# Altium project IFAT6.PrjPcb (part 3 of 3)

## Sheet Sig_Acq.SchDoc
size 457 x 254 mm; SPICEModelCacheCRLRCMOW: <root> / <DocumentId>CRLRCMOW</DocumentId> / <CacheFrame Number="0"> / <Model Name="cap" Kind="MDL"> / <Text>*Default semiconductor capacitor / .MODEL CAP C()</Text> / </Model> / </CacheFrame> / </root>
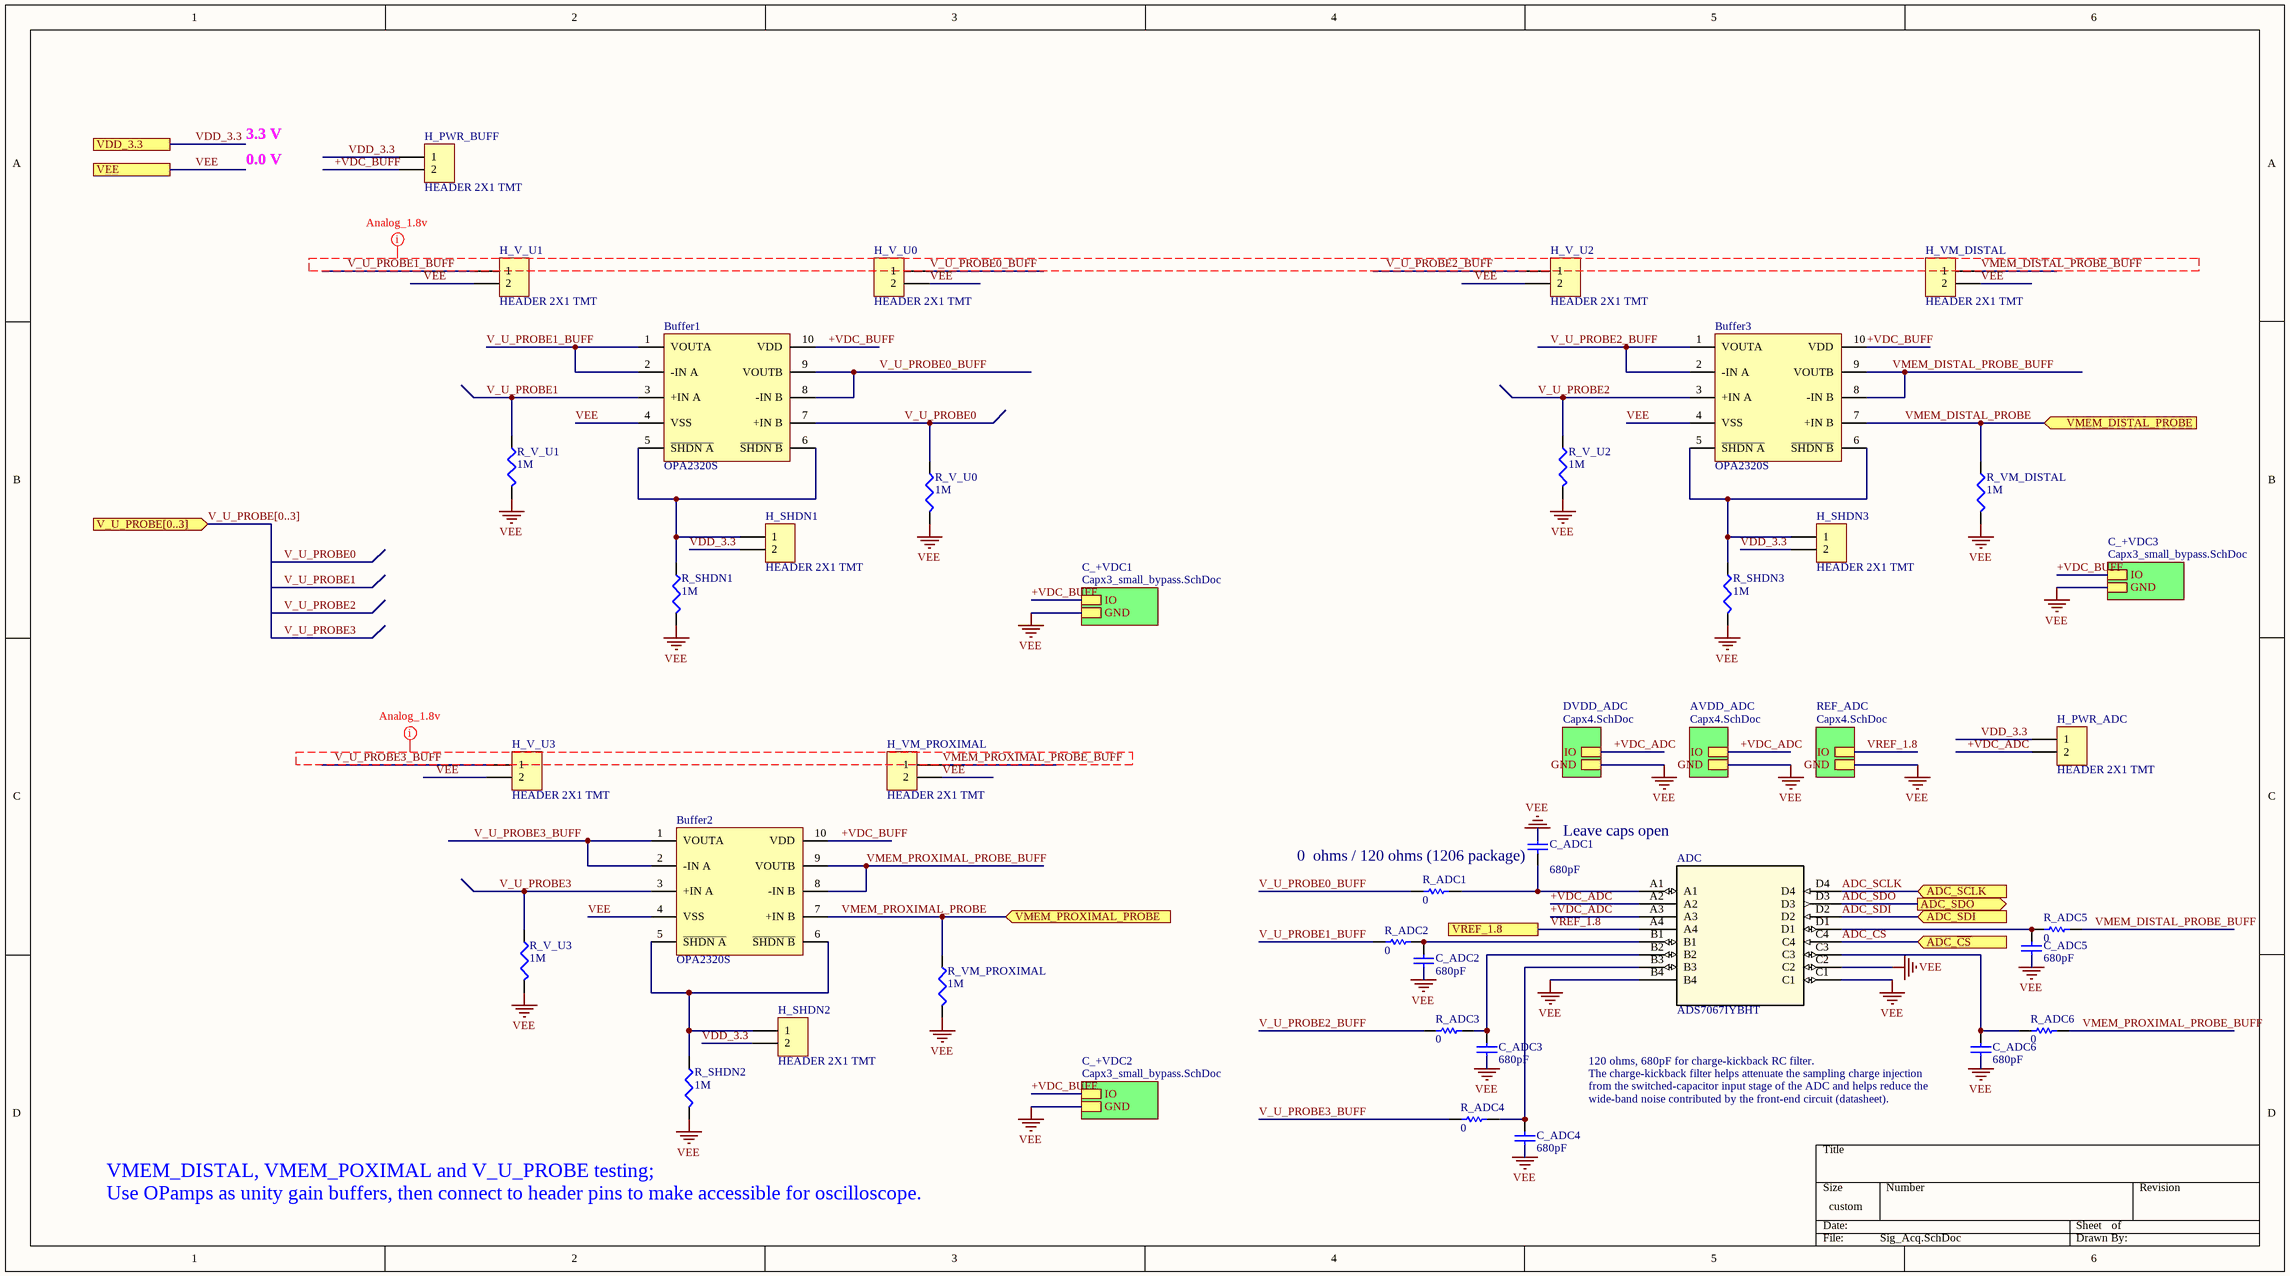
[diagram p10: Sig_Acq.SchDoc]

### Parts
ADC  ADS7067IYBHT  [BGA16_YBH_TEX]
Buffer1  OPA2320S  [TI OPA2320SAIDGSR]
Buffer2  OPA2320S  [TI OPA2320SAIDGSR]
Buffer3  OPA2320S  [TI OPA2320SAIDGSR]
C_ADC1  value 680pF  [THERM_NCP18XH103F03RB]  (hidden comment: Cap)
C_ADC2  value 680pF  [THERM_NCP18XH103F03RB]  (hidden comment: Cap)
C_ADC3  value 680pF  [THERM_NCP18XH103F03RB]  (hidden comment: Cap)
C_ADC4  value 680pF  [THERM_NCP18XH103F03RB]  (hidden comment: Cap)
C_ADC5  value 680pF  [THERM_NCP18XH103F03RB]  (hidden comment: Cap)
C_ADC6  value 680pF  [THERM_NCP18XH103F03RB]  (hidden comment: Cap)
H_PWR_ADC  HEADER 2X1 TMT  [Samtec TSW-102-07-G-S]
H_PWR_BUFF  HEADER 2X1 TMT  [Samtec TSW-102-07-G-S]
H_SHDN1  HEADER 2X1 TMT  [Samtec TSW-102-07-G-S]
H_SHDN2  HEADER 2X1 TMT  [Samtec TSW-102-07-G-S]
H_SHDN3  HEADER 2X1 TMT  [Samtec TSW-102-07-G-S]
H_V_U0  HEADER 2X1 TMT  [Samtec TSW-102-07-G-S]
H_V_U1  HEADER 2X1 TMT  [Samtec TSW-102-07-G-S]
H_V_U2  HEADER 2X1 TMT  [Samtec TSW-102-07-G-S]
H_V_U3  HEADER 2X1 TMT  [Samtec TSW-102-07-G-S]
H_VM_DISTAL  HEADER 2X1 TMT  [Samtec TSW-102-07-G-S]
H_VM_PROXIMAL  HEADER 2X1 TMT  [Samtec TSW-102-07-G-S]
R_ADC1  0  [RESC3216X70X50NL05T20]
R_ADC2  0  [RESC3216X70X50NL05T20]
R_ADC3  0  [RESC3216X70X50NL05T20]
R_ADC4  0  [RESC3216X70X50NL05T20]
R_ADC5  0  [RESC3216X70X50NL05T20]
R_ADC6  0  [RESC3216X70X50NL05T20]
R_SHDN1  value 1M  [Panasonic ERA-6A Series Resistor]  (hidden comment: Res 1M 0.1% 0805)
R_SHDN2  value 1M  [Panasonic ERA-6A Series Resistor]  (hidden comment: Res 1M 0.1% 0805)
R_SHDN3  value 1M  [Panasonic ERA-6A Series Resistor]  (hidden comment: Res 1M 0.1% 0805)
R_V_U0  value 1M  [Panasonic ERA-6A Series Resistor]  (hidden comment: Res 1M 0.1% 0805)
R_V_U1  value 1M  [Panasonic ERA-6A Series Resistor]  (hidden comment: Res 1M 0.1% 0805)
R_V_U2  value 1M  [Panasonic ERA-6A Series Resistor]  (hidden comment: Res 1M 0.1% 0805)
R_V_U3  value 1M  [Panasonic ERA-6A Series Resistor]  (hidden comment: Res 1M 0.1% 0805)
R_VM_DISTAL  value 1M  [Panasonic ERA-6A Series Resistor]  (hidden comment: Res 1M 0.1% 0805)
R_VM_PROXIMAL  value 1M  [Panasonic ERA-6A Series Resistor]  (hidden comment: Res 1M 0.1% 0805)

### Sub-sheets
AVDD_ADC = Capx4.SchDoc: IO, GND
C_+VDC1 = Capx3_small_bypass.SchDoc: IO, GND
C_+VDC2 = Capx3_small_bypass.SchDoc: IO, GND
C_+VDC3 = Capx3_small_bypass.SchDoc: IO, GND
DVDD_ADC = Capx4.SchDoc: IO, GND
REF_ADC = Capx4.SchDoc: IO, GND

### Ports
ADC_SCLK (in), ADC_SDI (in), ADC_SDO (out), ADC_~{CS} (in), V_U_PROBE[0..3] (in), VDD_3.3, VEE, VMEM_DISTAL_PROBE (in), VMEM_PROXIMAL_PROBE (in), VREF_1.8

### Nets
VEE: ADC.B4 ADC.C1 ADC.C2 Buffer1.4(VSS) Buffer2.4(VSS) Buffer3.4(VSS) C_ADC1.2 C_ADC2.2 C_ADC3.2 C_ADC4.2 C_ADC5.2 C_ADC6.2 H_V_U0.2 H_V_U1.2 H_V_U2.2 H_V_U3.2 H_VM_DISTAL.2 H_VM_PROXIMAL.2 R_SHDN1.2 R_SHDN2.2 R_SHDN3.2 R_V_U0.2 R_V_U1.2 R_V_U2.2 R_V_U3.2 R_VM_DISTAL.2 R_VM_PROXIMAL.2 ; port VEE, sheet C_+VDC3/GND, sheet C_+VDC2/GND, sheet C_+VDC1/GND, sheet DVDD_ADC/GND, sheet REF_ADC/GND, sheet AVDD_ADC/GND  [project net DGND]
+VDC_ADC: ADC.A2 ADC.A3 H_PWR_ADC.2 ; sheet DVDD_ADC/IO, sheet AVDD_ADC/IO
+VDC_BUFF: Buffer1.10(VDD) Buffer2.10(VDD) Buffer3.10(VDD) H_PWR_BUFF.2 ; sheet C_+VDC3/IO, sheet C_+VDC2/IO, sheet C_+VDC1/IO
ADC_~{CS}: ADC.C4 ; port ADC_~{CS}
ADC_SCLK: ADC.D4 ; port ADC_SCLK
ADC_SDI: ADC.D2 ; port ADC_SDI
ADC_SDO: ADC.D3 ; port ADC_SDO
V_U_PROBE0: Buffer1.7(+IN_B) R_V_U0.1
V_U_PROBE0_BUFF: Buffer1.8(-IN_B) Buffer1.9(VOUTB) H_V_U0.1 R_ADC1.1
V_U_PROBE1: Buffer1.3(+IN_A) R_V_U1.1
V_U_PROBE1_BUFF: Buffer1.1(VOUTA) Buffer1.2(-IN_A) H_V_U1.1 R_ADC2.1
V_U_PROBE2: Buffer3.3(+IN_A) R_V_U2.1
V_U_PROBE2_BUFF: Buffer3.1(VOUTA) Buffer3.2(-IN_A) H_V_U2.1 R_ADC3.1
V_U_PROBE3: Buffer2.3(+IN_A) R_V_U3.1
V_U_PROBE3_BUFF: Buffer2.1(VOUTA) Buffer2.2(-IN_A) H_V_U3.1 R_ADC4.1
VDD_3.3: H_PWR_ADC.1 H_PWR_BUFF.1 H_SHDN1.2 H_SHDN2.2 H_SHDN3.2 ; port VDD_3.3  [project net VDD3.3]
VMEM_DISTAL_PROBE: Buffer3.7(+IN_B) R_VM_DISTAL.1 ; port VMEM_DISTAL_PROBE
VMEM_DISTAL_PROBE_BUFF: Buffer3.8(-IN_B) Buffer3.9(VOUTB) H_VM_DISTAL.1 R_ADC5.2
VMEM_PROXIMAL_PROBE: Buffer2.7(+IN_B) R_VM_PROXIMAL.1 ; port VMEM_PROXIMAL_PROBE
VMEM_PROXIMAL_PROBE_BUFF: Buffer2.8(-IN_B) Buffer2.9(VOUTB) H_VM_PROXIMAL.1 R_ADC6.2
VREF_1.8: ADC.A4 ; port VREF_1.8, sheet REF_ADC/IO  [project net DAC_VREF_1.8]
NetADC_A1: ADC.A1 C_ADC1.1 R_ADC1.2
NetADC_B1: ADC.B1 C_ADC2.1 R_ADC2.2
NetADC_B2: ADC.B2 C_ADC3.1 R_ADC3.2
NetADC_B3: ADC.B3 C_ADC4.1 R_ADC4.2
NetADC_C3: ADC.C3 C_ADC6.1 R_ADC6.1
NetADC_D1: ADC.D1 C_ADC5.1 R_ADC5.1
NetBuffer1_5: Buffer1.5(~{SHDN_A}) Buffer1.6(~{SHDN_B}) H_SHDN1.1 R_SHDN1.1
NetBuffer2_5: Buffer2.5(~{SHDN_A}) Buffer2.6(~{SHDN_B}) H_SHDN2.1 R_SHDN2.1
NetBuffer3_5: Buffer3.5(~{SHDN_A}) Buffer3.6(~{SHDN_B}) H_SHDN3.1 R_SHDN3.1

### Buses and harness runs
bus V_U_PROBE[0..3] = port V_U_PROBE[0..3]

### Layout directives
net class Analog: V_U_PROBE0_BUFF, V_U_PROBE1_BUFF, V_U_PROBE2_BUFF, V_U_PROBE3_BUFF, VMEM_DISTAL_PROBE_BUFF, VMEM_PROXIMAL_PROBE_BUFF

### Notes on the sheet
- 3.3 V
- 0.0 V
- (near C_ADC1) Leave caps open
- (near C_ADC1) 0  ohms / 120 ohms (1206 package)
- 120 ohms, 680pF for charge-kickback RC filter.
- (near C_ADC6) The charge-kickback filter helps attenuate the sampling charge injection
- (near C_ADC6) from the switched-capacitor input stage of the ADC and helps reduce the
- wide-band noise contributed by the front-end circuit (datasheet).
- VMEM_DISTAL, VMEM_POXIMAL and V_U_PROBE testing;
  Use OPamps as unity gain buffers, then connect to header pins to make accessible for oscilloscope.

### Library data of the parts
ADC = ADS7067IYBHT: No Description Available; Mfr_Name: Texas Instruments; Copyright: Copyright (C) 2022 Ultra Librarian. All rights reserved.; Manufacturer_Part_Number: ADS7067IYBHT; RefDes: RefDes; Type: DEV
Buffer1-Buffer3 = OPA2320S: IC OPAMP RR CMOS 20MHZ 10VSSOP / CMOS Amplifier Circuit Rail-to-Rail 10-VSSOP; Supplier 1: Digi-Key; Supplier 2: Digi-Key; Supplier 3: Mouser; Supplier Part Number 1: 296-40455-1-ND; Supplier Part Number 2: 296-48160-1-ND; Supplier Part Number 3: 595-OPA2320SAIDGSR
C_ADC1-C_ADC6 = Cap: Capacitor; Published: 8-Jun-2000; LatestRevisionDate: 17-Jul-2002; LatestRevisionNote: Re-released for DXP Platform.; PackageReference: RAD-0.3; Publisher: Altium Limited; PackageDescription: Radial Cap, Thru-Hole; 2 Leads; 0.3 in Pin Spacing; Supplier 1: Mouser; Supplier Part Number 1: 81-GCM1885C1H681FAD
H_PWR_ADC H_PWR_BUFF H_SHDN1-H_SHDN3 H_V_U0-H_V_U3 H_VM_DISTAL H_VM_PROXIMAL = HEADER 2X1 TMT: CONN HEADER VERT 2POS 2.54MM / Connector Header Through Hole 2 position 0.100" (2.54mm); Supplier 1: Digi-Key; Supplier Part Number 1: SAM1029-02-ND
R_ADC1-R_ADC6 = CMP-2003-00541-1: Manufacturer: Panasonic; Part Number: ERJ-8GEY0R00V
R_SHDN1-R_SHDN3 R_V_U0-R_V_U3 R_VM_DISTAL R_VM_PROXIMAL = Res 1M 0.1% 0805: RES 1M OHM 0.1% 1/8W 0805 / 1 ±0.1% 0.125W, 1/8W Chip Resistor 0805 (2012 Metric) Automotive AEC-Q200 Thin Film; Supplier 1: Digi-Key; Supplier Part Number 1: P1MDACT-ND; Supplier 2: Digi-Key; Supplier Part Number 2: YAG1821CT-ND

## Sheet BRK7010_sj.SchDoc: BRK6110
size C; Author: Jake Janovetz; Organization: Opal Kelly; Address1: 13500 SW 72nd Ave, STE 120; Address2: Portland, OR 97223; Address4: http://www.opalkelly.com; DocumentNumber: xxx; Revision: 1; SheetNumber: 1; SheetTotal: 1; PageSetup: Record=PageOptions|CenterHorizontal=True|CenterVertical=True|PrintScale=0.54|XCorrection=1.00|YCorrection=1.00|PrintKind=0|BorderSize=5000000|LeftOffset=0|BottomOffset=0|Orientation=2|PaperLength=1000|PaperWidth=1000|Scale=100|PaperSource=7|PrintQuality=-4|MediaType=1|DitherType=10|PaperKind=Letter|PrintScaleMode=1
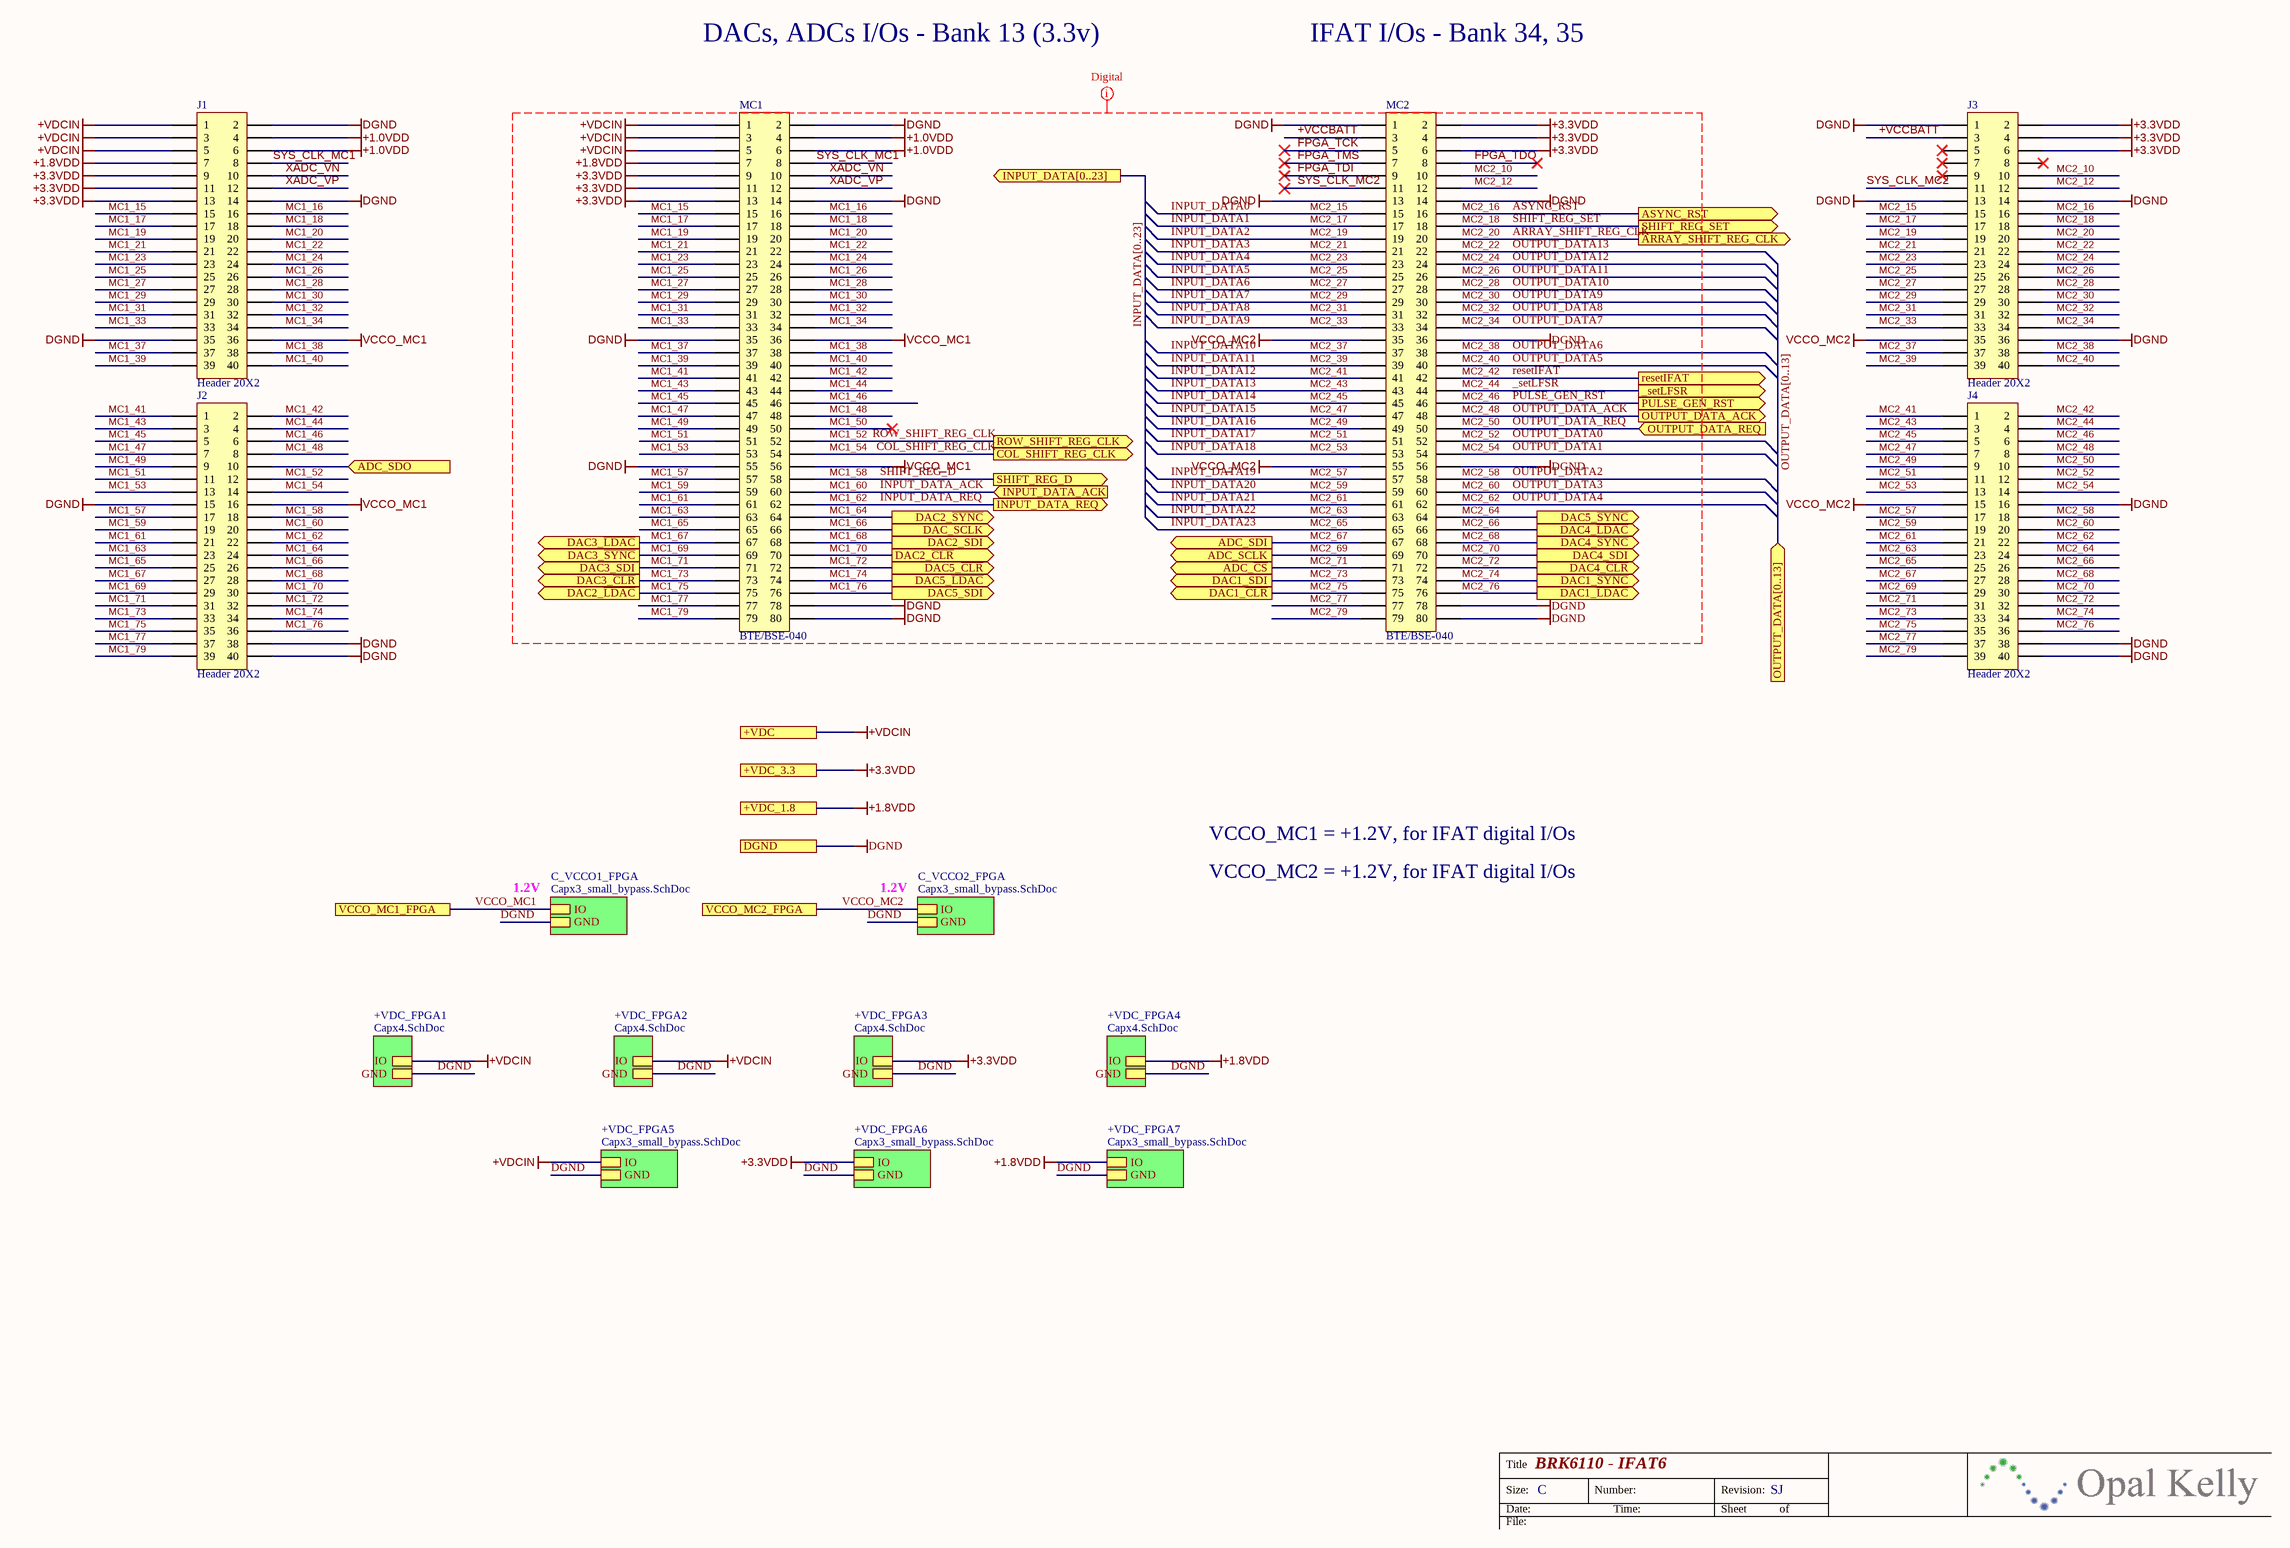
[diagram p11: BRK7010_sj.SchDoc]

### Parts
J1  Header 20X2  [Samtec TMMH-120-01-F-D]
J2  Header 20X2  [Samtec TMMH-120-01-F-D]
J3  Header 20X2  [Samtec TMMH-120-01-F-D]
J4  Header 20X2  [Samtec TMMH-120-01-F-D]
MC1  BTE/BSE-040  [Samtec BTE-040-01-L-D-A]
MC2  BTE/BSE-040  [Samtec BTE-040-01-L-D-A]

### Sub-sheets
+VDC_FPGA1 = Capx4.SchDoc: IO, GND
+VDC_FPGA2 = Capx4.SchDoc: IO, GND
+VDC_FPGA3 = Capx4.SchDoc: IO, GND
+VDC_FPGA4 = Capx4.SchDoc: IO, GND
+VDC_FPGA5 = Capx3_small_bypass.SchDoc: IO, GND
+VDC_FPGA6 = Capx3_small_bypass.SchDoc: IO, GND
+VDC_FPGA7 = Capx3_small_bypass.SchDoc: IO, GND
C_VCCO1_FPGA = Capx3_small_bypass.SchDoc: IO, GND
C_VCCO2_FPGA = Capx3_small_bypass.SchDoc: IO, GND

### Ports
+VDC, +VDC_1.8, +VDC_3.3, _setLFSR (out), ADC_SCLK (out), ADC_SDI (out), ADC_SDO (in), ADC_~{CS} (out), ARRAY_SHIFT_REG_CLK (out), ASYNC_RST (out), COL_SHIFT_REG_CLK (out), DAC1_SDI (out), DAC1_~{CLR} (out), DAC1_~{LDAC} (out), DAC1_~{SYNC} (out), DAC2_SDI (out), DAC2_~{CLR} (out), DAC2_~{LDAC} (out), DAC2_~{SYNC} (out), DAC3_SDI (out), DAC3_~{CLR} (out), DAC3_~{LDAC} (out), DAC3_~{SYNC} (out), DAC4_SDI (out), DAC4_~{CLR} (out), DAC4_~{LDAC} (out), DAC4_~{SYNC} (out), DAC5_SDI (out), DAC5_~{CLR} (out), DAC5_~{LDAC} (out), DAC5_~{SYNC} (out), DAC_SCLK (out), DGND, INPUT_DATA[0..23] (out), INPUT_DATA_ACK (in), INPUT_DATA_REQ (out), OUTPUT_DATA[0..13] (in), OUTPUT_DATA_ACK (out), OUTPUT_DATA_REQ (in), PULSE_GEN_RST (out), resetIFAT (out), ROW_SHIFT_REG_CLK (out), SHIFT_REG_D (out), SHIFT_REG_SET (out), VCCO_MC1_FPGA, VCCO_MC2_FPGA

### Nets
+1.0VDD: J1.4 J1.6 MC1.4 MC1.6
+1.8VDD: J1.7 MC1.7 ; port +VDC_1.8, sheet +VDC_FPGA4/IO, sheet +VDC_FPGA7/IO  [project net +VDC_1.8]
+3.3VDD: J1.9 J1.11 J1.13 J3.2 J3.4 J3.6 MC1.9 MC1.11 MC1.13 MC2.2 MC2.4 MC2.6 ; port +VDC_3.3, sheet +VDC_FPGA3/IO, sheet +VDC_FPGA6/IO  [project net +VDC_3.3]
+VDCIN: J1.1 J1.3 J1.5 MC1.1 MC1.3 MC1.5 ; port +VDC, sheet +VDC_FPGA1/IO, sheet +VDC_FPGA2/IO, sheet +VDC_FPGA5/IO  [project net +VDC]
DGND: J1.2 J1.14 J1.35 J2.15 J2.38 J2.40 J3.1 J3.13 J3.14 J3.36 J4.16 J4.38 J4.40 MC1.2 MC1.14 MC1.35 MC1.55 MC1.78 MC1.80 MC2.1 MC2.13 MC2.14 MC2.36 MC2.56 MC2.78 MC2.80 ; port DGND, sheet +VDC_FPGA1/GND, sheet C_VCCO2_FPGA/GND, sheet +VDC_FPGA2/GND, sheet +VDC_FPGA3/GND, sheet +VDC_FPGA5/GND, sheet +VDC_FPGA6/GND, sheet +VDC_FPGA4/GND, sheet +VDC_FPGA7/GND, sheet C_VCCO1_FPGA/GND
VCCO_MC1: J1.36 J2.16 J3.35 J4.15 MC1.36 MC1.56 MC2.35 MC2.55 ; port VCCO_MC2_FPGA, port VCCO_MC1_FPGA, sheet C_VCCO2_FPGA/IO, sheet C_VCCO1_FPGA/IO  [also labelled VCCO_MC2]
+VCCBATT: J3.3 MC2.3
_setLFSR: J4.4 MC2.44 ; port _setLFSR  [also labelled MC2_44]
ADC_SDO: J2.10 ; port ADC_SDO
ARRAY_SHIFT_REG_CLK: J3.20 MC2.20 ; port ARRAY_SHIFT_REG_CLK  [also labelled MC2_20]
ASYNC_RST: J3.16 MC2.16 ; port ASYNC_RST  [also labelled MC2_16]
COL_SHIFT_REG_CLK: J2.14 MC1.54 ; port COL_SHIFT_REG_CLK  [also labelled MC1_54]
FPGA_TCK: MC2.5
FPGA_TDI: MC2.9
FPGA_TDO: MC2.8
FPGA_TMS: MC2.7
INPUT_DATA0: J3.15 MC2.15  [also labelled MC2_15]
INPUT_DATA1: J3.17 MC2.17  [also labelled MC2_17]
INPUT_DATA2: J3.19 MC2.19  [also labelled MC2_19]
INPUT_DATA3: J3.21 MC2.21  [also labelled MC2_21]
INPUT_DATA4: J3.23 MC2.23  [also labelled MC2_23]
INPUT_DATA5: J3.25 MC2.25  [also labelled MC2_25]
INPUT_DATA6: J3.27 MC2.27  [also labelled MC2_27]
INPUT_DATA7: J3.29 MC2.29  [also labelled MC2_29]
INPUT_DATA8: J3.31 MC2.31  [also labelled MC2_31]
INPUT_DATA9: J3.33 MC2.33  [also labelled MC2_33]
INPUT_DATA10: J3.37 MC2.37  [also labelled MC2_37]
INPUT_DATA11: J3.39 MC2.39  [also labelled MC2_39]
INPUT_DATA12: J4.1 MC2.41  [also labelled MC2_41]
INPUT_DATA13: J4.3 MC2.43  [also labelled MC2_43]
INPUT_DATA14: J4.5 MC2.45  [also labelled MC2_45]
INPUT_DATA15: J4.7 MC2.47  [also labelled MC2_47]
INPUT_DATA16: J4.9 MC2.49  [also labelled MC2_49]
INPUT_DATA17: J4.11 MC2.51  [also labelled MC2_51]
INPUT_DATA18: J4.13 MC2.53  [also labelled MC2_53]
INPUT_DATA19: J4.17 MC2.57  [also labelled MC2_57]
INPUT_DATA20: J4.19 MC2.59  [also labelled MC2_59]
INPUT_DATA21: J4.21 MC2.61  [also labelled MC2_61]
INPUT_DATA22: J4.23 MC2.63  [also labelled MC2_63]
INPUT_DATA23: J4.25 MC2.65  [also labelled MC2_65]
INPUT_DATA_ACK: J2.20 MC1.60 ; port INPUT_DATA_ACK  [also labelled MC1_60]
INPUT_DATA_REQ: J2.22 MC1.62 ; port INPUT_DATA_REQ  [also labelled MC1_62]
MC1_15: J1.15 MC1.15
MC1_16: J1.16 MC1.16
MC1_17: J1.17 MC1.17
MC1_18: J1.18 MC1.18
MC1_19: J1.19 MC1.19
MC1_20: J1.20 MC1.20
MC1_21: J1.21 MC1.21
MC1_22: J1.22 MC1.22
MC1_23: J1.23 MC1.23
MC1_24: J1.24 MC1.24
MC1_25: J1.25 MC1.25
MC1_26: J1.26 MC1.26
MC1_27: J1.27 MC1.27
MC1_28: J1.28 MC1.28
MC1_29: J1.29 MC1.29
MC1_30: J1.30 MC1.30
MC1_31: J1.31 MC1.31
MC1_32: J1.32 MC1.32
MC1_33: J1.33 MC1.33
MC1_34: J1.34 MC1.34
MC1_37: J1.37 MC1.37
MC1_38: J1.38 MC1.38
MC1_39: J1.39 MC1.39
MC1_40: J1.40 MC1.40
MC1_41: J2.1 MC1.41
MC1_42: J2.2 MC1.42
MC1_43: J2.3 MC1.43
MC1_44: J2.4 MC1.44
MC1_45: J2.5 MC1.45
MC1_46: J2.6 MC1.46
MC1_47: J2.7 MC1.47
MC1_48: J2.8 MC1.48
MC1_49: J2.9 MC1.49
MC1_50: MC1.50
MC1_51: J2.11 MC1.51
MC1_52: J2.12 MC1.52 ; port ROW_SHIFT_REG_CLK  [also labelled ROW_SHIFT_REG_CLK]
MC1_53: J2.13 MC1.53
MC1_57: J2.17 MC1.57
MC1_58: J2.18 MC1.58 ; port SHIFT_REG_D  [also labelled SHIFT_REG_D]
MC1_59: J2.19 MC1.59
MC1_61: J2.21 MC1.61
MC1_63: J2.23 MC1.63
MC1_64: J2.24 MC1.64 ; port DAC2_~{SYNC}  [project net DAC2_~{SYNC}]
MC1_65: J2.25 MC1.65
MC1_66: J2.26 MC1.66 ; port DAC_SCLK  [project net DAC_SCLK]
MC1_67: J2.27 MC1.67 ; port DAC3_~{LDAC}  [project net DAC3_~{LDAC}]
MC1_68: J2.28 MC1.68 ; port DAC2_SDI  [project net DAC2_SDI]
MC1_69: J2.29 MC1.69 ; port DAC3_~{SYNC}  [project net DAC3_~{SYNC}]
MC1_70: J2.30 MC1.70 ; port DAC2_~{CLR}  [project net DAC2_~{CLR}]
MC1_71: J2.31 MC1.71 ; port DAC3_SDI  [project net DAC3_SDI]
MC1_72: J2.32 MC1.72 ; port DAC5_~{CLR}  [project net DAC5_~{CLR}]
MC1_73: J2.33 MC1.73 ; port DAC3_~{CLR}  [project net DAC3_~{CLR}]
MC1_74: J2.34 MC1.74 ; port DAC5_~{LDAC}  [project net DAC5_~{LDAC}]
MC1_75: J2.35 MC1.75 ; port DAC2_~{LDAC}  [project net DAC2_~{LDAC}]
MC1_76: J2.36 MC1.76 ; port DAC5_SDI  [project net DAC5_SDI]
MC1_77: J2.37 MC1.77
MC1_79: J2.39 MC1.79
MC2_10: J3.10 MC2.10
MC2_12: J3.12 MC2.12
MC2_18: J3.18 MC2.18 ; port SHIFT_REG_SET  [also labelled SHIFT_REG_SET]
MC2_22: J3.22 MC2.22  [also labelled OUTPUT_DATA13]
MC2_24: J3.24 MC2.24  [also labelled OUTPUT_DATA12]
MC2_26: J3.26 MC2.26  [also labelled OUTPUT_DATA11]
MC2_28: J3.28 MC2.28  [also labelled OUTPUT_DATA10]
MC2_30: J3.30 MC2.30  [also labelled OUTPUT_DATA9]
MC2_32: J3.32 MC2.32  [also labelled OUTPUT_DATA8]
MC2_34: J3.34 MC2.34  [also labelled OUTPUT_DATA7]
MC2_38: J3.38 MC2.38  [also labelled OUTPUT_DATA6]
MC2_40: J3.40 MC2.40  [also labelled OUTPUT_DATA5]
MC2_42: J4.2 MC2.42 ; port resetIFAT  [also labelled resetIFAT]
MC2_46: J4.6 MC2.46 ; port PULSE_GEN_RST  [also labelled PULSE_GEN_RST]
MC2_48: J4.8 MC2.48 ; port OUTPUT_DATA_ACK  [also labelled OUTPUT_DATA_ACK]
MC2_50: J4.10 MC2.50 ; port OUTPUT_DATA_REQ  [also labelled OUTPUT_DATA_REQ]
MC2_52: J4.12 MC2.52  [also labelled OUTPUT_DATA0]
MC2_54: J4.14 MC2.54  [also labelled OUTPUT_DATA1]
MC2_58: J4.18 MC2.58  [also labelled OUTPUT_DATA2]
MC2_60: J4.20 MC2.60  [also labelled OUTPUT_DATA3]
MC2_62: J4.22 MC2.62  [also labelled OUTPUT_DATA4]
MC2_64: J4.24 MC2.64 ; port DAC5_~{SYNC}  [project net DAC5_~{SYNC}]
MC2_66: J4.26 MC2.66 ; port DAC4_~{LDAC}  [project net DAC4_~{LDAC}]
MC2_67: J4.27 MC2.67 ; port ADC_SDI  [project net ADC_SDI]
MC2_68: J4.28 MC2.68 ; port DAC4_~{SYNC}  [project net DAC4_~{SYNC}]
MC2_69: J4.29 MC2.69 ; port ADC_SCLK  [project net ADC_SCLK]
MC2_70: J4.30 MC2.70 ; port DAC4_SDI  [project net DAC4_SDI]
MC2_71: J4.31 MC2.71 ; port ADC_~{CS}  [project net ADC_~{CS}]
MC2_72: J4.32 MC2.72 ; port DAC4_~{CLR}  [project net DAC4_~{CLR}]
MC2_73: J4.33 MC2.73 ; port DAC1_SDI  [project net DAC1_SDI]
MC2_74: J4.34 MC2.74 ; port DAC1_~{SYNC}  [project net DAC1_~{SYNC}]
MC2_75: J4.35 MC2.75 ; port DAC1_~{CLR}  [project net DAC1_~{CLR}]
MC2_76: J4.36 MC2.76 ; port DAC1_~{LDAC}  [project net DAC1_~{LDAC}]
MC2_77: J4.37 MC2.77
MC2_79: J4.39 MC2.79
SYS_CLK_MC1: J1.8 MC1.8
SYS_CLK_MC2: J3.11 MC2.11
XADC_VN: J1.10 MC1.10
XADC_VP: J1.12 MC1.12

Not connected (* = marked no-connect by the designer): J3 5* 7* 8* 9*

### Buses and harness runs
bus INPUT_DATA[0..23] = port INPUT_DATA[0..23]
bus OUTPUT_DATA[0..13] = port OUTPUT_DATA[0..13]

### Layout directives
net class Digital: +1.0VDD, +1.8VDD, +3.3VDD, +VCCBATT, +VDCIN, _setLFSR, ARRAY_SHIFT_REG_CLK, ASYNC_RST, COL_SHIFT_REG_CLK, DGND, FPGA_TCK, FPGA_TDI, FPGA_TDO, FPGA_TMS, INPUT_DATA0, INPUT_DATA1, INPUT_DATA2, INPUT_DATA3, INPUT_DATA4, INPUT_DATA5, INPUT_DATA6, INPUT_DATA7, INPUT_DATA8, INPUT_DATA9, INPUT_DATA10, INPUT_DATA11, INPUT_DATA12, INPUT_DATA13, INPUT_DATA14, INPUT_DATA15, INPUT_DATA16, INPUT_DATA17, INPUT_DATA18, INPUT_DATA19, INPUT_DATA20, INPUT_DATA21, INPUT_DATA22, INPUT_DATA23, INPUT_DATA[0..23], INPUT_DATA_ACK, INPUT_DATA_REQ, MC1_15, MC1_16, MC1_17, MC1_18, MC1_19, MC1_20, MC1_21, MC1_22, MC1_23, MC1_24, MC1_25, MC1_26, MC1_27, MC1_28, MC1_29, MC1_30, MC1_31, MC1_32, MC1_33, MC1_34, MC1_37, MC1_38, MC1_39, MC1_40, MC1_41, MC1_42, MC1_43, MC1_44, MC1_45, MC1_46, MC1_47, MC1_48, MC1_49, MC1_50, MC1_51, MC1_52, MC1_53, MC1_54, MC1_57, MC1_58, MC1_59, MC1_60, MC1_61, MC1_62, MC1_63, MC1_64, MC1_65, MC1_66, MC1_67, MC1_68, MC1_69, MC1_70, MC1_71, MC1_72, MC1_73, MC1_74, MC1_75, MC1_76, MC1_77, MC1_79, MC2_10, MC2_12, MC2_15, MC2_16, MC2_17, MC2_18, MC2_19, MC2_20, MC2_21, MC2_22, MC2_23, MC2_24, MC2_25, MC2_26, MC2_27, MC2_28, MC2_29, MC2_30, MC2_31, MC2_32, MC2_33, MC2_34, MC2_37, MC2_38, MC2_39, MC2_40, MC2_41, MC2_42, MC2_43, MC2_44, MC2_45, MC2_46, MC2_47, MC2_48, MC2_49, MC2_50, MC2_51, MC2_52, MC2_53, MC2_54, MC2_57, MC2_58, MC2_59, MC2_60, MC2_61, MC2_62, MC2_63, MC2_64, MC2_65, MC2_66, MC2_67, MC2_68, MC2_69, MC2_70, MC2_71, MC2_72, MC2_73, MC2_74, MC2_75, MC2_76, MC2_77, MC2_79, OUTPUT_DATA0, OUTPUT_DATA1, OUTPUT_DATA2, OUTPUT_DATA3, OUTPUT_DATA4, OUTPUT_DATA5, OUTPUT_DATA6, OUTPUT_DATA7, OUTPUT_DATA8, OUTPUT_DATA9, OUTPUT_DATA10, OUTPUT_DATA11, OUTPUT_DATA12, OUTPUT_DATA13, OUTPUT_DATA_ACK, OUTPUT_DATA_REQ, PULSE_GEN_RST, resetIFAT, ROW_SHIFT_REG_CLK, SHIFT_REG_D, SHIFT_REG_SET, SYS_CLK_MC1, SYS_CLK_MC2, VCCO_MC1, VCCO_MC2, XADC_VN, XADC_VP

### Notes on the sheet
- DACs, ADCs I/Os - Bank 13 (3.3v)
- IFAT I/Os - Bank 34, 35
- 1.2V
- VCCO_MC2 = +1.2V, for IFAT digital I/Os
- VCCO_MC1 = +1.2V, for IFAT digital I/Os
- Title
- Size:
- Date:
- File:
- BRK6110 - IFAT6
- C
- Number:
- Time:
- Revision:
- Sheet
- SJ
- of

### Library data of the parts
J1-J4 = Header 20X2: 2MM LOW PROFILE STRIPS / Connector Header position; Manufacturer: Generic Components; Revision: July-2002: Re-released for DXP Platform.; Publisher: Altium Limited; Class I: Connector; Supplier 1: Digi-Key; Supplier Part Number 1: TMMH-120-01-F-D-ND
MC1 MC2 = BTE/BSE-040: Board Stacking Connector, 80 Contact(s), 2 Row(s), Male, Straight, 0.031 inch Pitch, Surface Mount Terminal, Receptacle; Date: November 14, 2003; Supplier 1: Digi-Key; Supplier Part Number 1: SAM8745-ND

## Nets that join several sheets
+VDC: Power (H_PWR_5V.1), BRK7010_sj (6 pins), BRK7010/+VDC_FPGA1 (C1_+VDC_FPGA1.1 C2_+VDC_FPGA1.1 C3_+VDC_FPGA1.1 C4_+VDC_FPGA1.1), BRK7010/+VDC_FPGA2 (C1_+VDC_FPGA2.1 C2_+VDC_FPGA2.1 C3_+VDC_FPGA2.1 C4_+VDC_FPGA2.1), BRK7010/+VDC_FPGA5 (C1_+VDC_FPGA5.1 C2_+VDC_FPGA5.2 C3_+VDC_FPGA5.2)
+VDC_1.8: Power (H_PWR_1.8V.1), BRK7010_sj (J1.7 MC1.7), BRK7010/+VDC_FPGA4 (C1_+VDC_FPGA4.1 C2_+VDC_FPGA4.1 C3_+VDC_FPGA4.1 C4_+VDC_FPGA4.1), BRK7010/+VDC_FPGA7 (C1_+VDC_FPGA7.1 C2_+VDC_FPGA7.2 C3_+VDC_FPGA7.2)
+VDC_3.3: Power (H_PWR_3.3V.1 H_VDD_3.3.1), BRK7010_sj (12 pins), BRK7010/+VDC_FPGA3 (C1_+VDC_FPGA3.1 C2_+VDC_FPGA3.1 C3_+VDC_FPGA3.1 C4_+VDC_FPGA3.1), BRK7010/+VDC_FPGA6 (C1_+VDC_FPGA6.1 C2_+VDC_FPGA6.2 C3_+VDC_FPGA6.2)
DGND: IFAT6_QFP (6 pins), IFAT6_Chip_QFP/C_EVDD (C1_IFAT6_Chip_QFP_C_EVDD#1.2 C2_IFAT6_Chip_QFP_C_EVDD#1.1 C3_IFAT6_Chip_QFP_C_EVDD#1.1), IFAT6_Chip_QFP/DVDD_HI (C1_DVDD_HI.2 C2_DVDD_HI.1 C3_DVDD_HI.1), IFAT6_Chip_QFP/DVDD (C1_DVDD.2 C2_DVDD.1 C3_DVDD.1), IFAT6_Chip_QFP/VSS_SYN (C1_VSS_SYN.2 C2_VSS_SYN.1 C3_VSS_SYN.1), IFAT6_Chip_QFP/VAMP_LOW (C1_VAMP_LOW.2 C2_VAMP_LOW.1 C3_VAMP_LOW.1), IFAT6_Chip_QFP/C_EVDD (C1_IFAT6_Chip_QFP_C_EVDD#2.2 C2_IFAT6_Chip_QFP_C_EVDD#2.1 C3_IFAT6_Chip_QFP_C_EVDD#2.1), IFAT6_Chip_QFP/GCOMP (C1_GCOMP.2 C2_GCOMP.1 C3_GCOMP.1), IFAT6_Chip_QFP/ELEAK (C1_ELEAK.2 C2_ELEAK.1 C3_ELEAK.1), IFAT6_Chip_QFP/C_AVDD (C1_C_AVDD.2 C2_C_AVDD.1 C3_C_AVDD.1), IFAT6_Chip_QFP/GL_DIS (C1_GL_DIS.2 C2_GL_DIS.1 C3_GL_DIS.1), IFAT6_Chip_QFP/GL_PROX (C1_GL_PROX.2 C2_GL_PROX.1 C3_GL_PROX.1), IFAT6_Chip_QFP/V_TAU3 (C1_V_TAU3.2 C2_V_TAU3.1 C3_V_TAU3.1), IFAT6_Chip_QFP/V_TAU2 (C1_V_TAU2.2 C2_V_TAU2.1 C3_V_TAU2.1), IFAT6_Chip_QFP/C_AVDD1 (C1_C_AVDD1.2 C2_C_AVDD1.1 C3_C_AVDD1.1), IFAT6_Chip_QFP/V_TAU0 (C1_V_TAU0.2 C2_V_TAU0.1 C3_V_TAU0.1), IFAT6_Chip_QFP/VREFR (C1_VREFR.2 C2_VREFR.1 C3_VREFR.1), IFAT6_Chip_QFP/V_TAU1 (C1_V_TAU1.2 C2_V_TAU1.1 C3_V_TAU1.1), IFAT6_Chip_QFP/VAMP_HIGH (C1_VAMP_HIGH.2 C2_VAMP_HIGH.1 C3_VAMP_HIGH.1), IFAT6_Chip_QFP/VBIAS_BUFF (C1_VBIAS_BUFF.2 C2_VBIAS_BUFF.1 C3_VBIAS_BUFF.1), IFAT6_Chip_QFP/SYN_DR_LO (C1_SYN_DR_LO.2 C2_SYN_DR_LO.1 C3_SYN_DR_LO.1), IFAT6_Chip_QFP/VBIAS_SF (C1_VBIAS_SF.2 C2_VBIAS_SF.1 C3_VBIAS_SF.1), IFAT6_Chip_QFP/E_REV0 (C1_E_REV0.2 C2_E_REV0.1 C3_E_REV0.1), IFAT6_Chip_QFP/E_REV1 (C1_E_REV1.2 C2_E_REV1.1 C3_E_REV1.1), IFAT6_Chip_QFP/E_REV2 (C1_E_REV2.2 C2_E_REV2.1 C3_E_REV2.1), IFAT6_Chip_QFP/E_REV3 (C1_E_REV3.2 C2_E_REV3.1 C3_E_REV3.1), IFAT6_Chip_QFP/VSPIKE (C1_VSPIKE.2 C2_VSPIKE.1 C3_VSPIKE.1), IFAT6_Chip_QFP/WBIAS (C1_WBIAS.2 C2_WBIAS.1 C3_WBIAS.1), IFAT6_Chip_QFP/VPDN (C1_VPDN.2 C2_VPDN.1 C3_VPDN.1), IFAT6_Chip_QFP/VBIAS (C1_VBIAS.2 C2_VBIAS.1 C3_VBIAS.1), IFAT6_Chip_QFP/VRESET (C1_VRESET.2 C2_VRESET.1 C3_VRESET.1), IFAT6_Chip_QFP/VTHRESH (C1_VTHRESH.2 C2_VTHRESH.1 C3_VTHRESH.1), IFAT6_Chip_QFP/VIN_IBIAS (C1_VIN_IBIAS.2 C2_VIN_IBIAS.1 C3_VIN_IBIAS.1), IFAT6_Chip_QFP/WBIAS_HI (C1_WBIAS_HI.2 C2_WBIAS_HI.1 C3_WBIAS_HI.1), IFAT6_Chip_QFP/WBIAS_LO (C1_WBIAS_LO.2 C2_WBIAS_LO.1 C3_WBIAS_LO.1), IFAT6_Chip_QFP/VBP (C1_VBP.2 C2_VBP.1 C3_VBP.1), IFAT6_Chip_QFP/VpupReq (C1_VpupReq.2 C2_VpupReq.1 C3_VpupReq.1), IFAT6_Chip_QFP/VpupArb (C1_VpupArb.2 C2_VpupArb.1 C3_VpupArb.1), Power (22 pins), LDO_All (8 pins), Power/LDO_All/AVDD (7 pins), Power/LDO_All/AVDD/U_Capx4 (C1_Power_LDO_All_AVDD_U_Capx4.2 C2_Power_LDO_All_AVDD_U_Capx4.2 C3_Power_LDO_All_AVDD_U_Capx4.2 C4_Power_LDO_All_AVDD_U_Capx4.2), Power/LDO_All/DVDD_HIGH (7 pins), Power/LDO_All/DVDD_HIGH/U_Capx4 (C1_Power_LDO_All_DVDD_HIGH_U_Capx4.2 C2_Power_LDO_All_DVDD_HIGH_U_Capx4.2 C3_Power_LDO_All_DVDD_HIGH_U_Capx4.2 C4_Power_LDO_All_DVDD_HIGH_U_Capx4.2), Power/LDO_All/EVDD (7 pins), Power/LDO_All/EVDD/U_Capx4 (C1_Power_LDO_All_EVDD_U_Capx4.2 C2_Power_LDO_All_EVDD_U_Capx4.2 C3_Power_LDO_All_EVDD_U_Capx4.2 C4_Power_LDO_All_EVDD_U_Capx4.2), Power/LDO_All/DVDD (7 pins), Power/LDO_All/DVDD/U_Capx4 (C1_Power_LDO_All_DVDD_U_Capx4.2 C2_Power_LDO_All_DVDD_U_Capx4.2 C3_Power_LDO_All_DVDD_U_Capx4.2 C4_Power_LDO_All_DVDD_U_Capx4.2), Power/LDO_All/VDD_3.3 (7 pins), Power/LDO_All/VDD_3.3/U_Capx4 (C1_Power_LDO_All_VDD_3.3_U_Capx4.2 C2_Power_LDO_All_VDD_3.3_U_Capx4.2 C3_Power_LDO_All_VDD_3.3_U_Capx4.2 C4_Power_LDO_All_VDD_3.3_U_Capx4.2), Power/LDO_All/VREF_2v (7 pins), Power/LDO_All/VREF_2v/U_Capx4 (C1_Power_LDO_All_VREF_2v_U_Capx4.2 C2_Power_LDO_All_VREF_2v_U_Capx4.2 C3_Power_LDO_All_VREF_2v_U_Capx4.2 C4_Power_LDO_All_VREF_2v_U_Capx4.2), Power/LDO_All/VREF_1.8 (7 pins), Power/LDO_All/VREF_1.8/U_Capx4 (C1_Power_LDO_All_VREF_1.8_U_Capx4.2 C2_Power_LDO_All_VREF_1.8_U_Capx4.2 C3_Power_LDO_All_VREF_1.8_U_Capx4.2 C4_Power_LDO_All_VREF_1.8_U_Capx4.2), Power/LDO_All/VDD_1.2 (7 pins), Power/LDO_All/VDD_1.2/U_Capx4 (C1_Power_LDO_All_VDD_1.2_U_Capx4.2 C2_Power_LDO_All_VDD_1.2_U_Capx4.2 C3_Power_LDO_All_VDD_1.2_U_Capx4.2 C4_Power_LDO_All_VDD_1.2_U_Capx4.2), DAC (5 pins), Power/DAC/VREF_1.8_DAC (C1_VREF_1.8_DAC.2 C2_VREF_1.8_DAC.2 C3_VREF_1.8_DAC.2 C4_VREF_1.8_DAC.2), Power/DAC/AVDD_DAC (C1_AVDD_DAC.2 C2_AVDD_DAC.2 C3_AVDD_DAC.2 C4_AVDD_DAC.2), Power/DAC/EVDD_DAC (C1_EVDD_DAC.2 C2_EVDD_DAC.2 C3_EVDD_DAC.2 C4_EVDD_DAC.2), Power/DAC/DVDD_DAC (C1_DVDD_DAC.2 C2_DVDD_DAC.2 C3_DVDD_DAC.2 C4_DVDD_DAC.2), Power/DAC/DVDD_HI_DAC (C1_DVDD_HI_DAC.2 C2_DVDD_HI_DAC.2 C3_DVDD_HI_DAC.2 C4_DVDD_HI_DAC.2), Power/DAC/VREF_2_DAC (C1_VREF_2_DAC.2 C2_VREF_2_DAC.2 C3_VREF_2_DAC.2 C4_VREF_2_DAC.2), Power/DAC/VREF_DAC1 (C1_VREF_DAC1.2 C2_VREF_DAC1.2 C3_VREF_DAC1.2 C4_VREF_DAC1.2), Power/DAC/VDC_DAC1 (C1_VDC_DAC1.2 C2_VDC_DAC1.2 C3_VDC_DAC1.2 C4_VDC_DAC1.2), Power/DAC/VREF_DAC2 (C1_VREF_DAC2.2 C2_VREF_DAC2.2 C3_VREF_DAC2.2 C4_VREF_DAC2.2), Power/DAC/VDC_DAC2 (C1_VDC_DAC2.2 C2_VDC_DAC2.2 C3_VDC_DAC2.2 C4_VDC_DAC2.2), Power/DAC/VREF_DAC3 (C1_VREF_DAC3.2 C2_VREF_DAC3.2 C3_VREF_DAC3.2 C4_VREF_DAC3.2), Power/DAC/VDC_DAC3 (C1_VDC_DAC3.2 C2_VDC_DAC3.2 C3_VDC_DAC3.2 C4_VDC_DAC3.2), Power/DAC/VREF_DAC4 (C1_VREF_DAC4.2 C2_VREF_DAC4.2 C3_VREF_DAC4.2 C4_VREF_DAC4.2), Power/DAC/VDC_DAC4 (C1_VDC_DAC4.2 C2_VDC_DAC4.2 C3_VDC_DAC4.2 C4_VDC_DAC4.2), Power/DAC/VREF_DAC5 (C1_VREF_DAC5.2 C2_VREF_DAC5.2 C3_VREF_DAC5.2 C4_VREF_DAC5.2), Power/DAC/VDC_DAC5 (C1_VDC_DAC5.2 C2_VDC_DAC5.2 C3_VDC_DAC5.2 C4_VDC_DAC5.2), Power/DAC/VTAU1_DAC (C1_VTAU1_DAC.2 C2_VTAU1_DAC.2 C3_VTAU1_DAC.2 C4_VTAU1_DAC.2), Power/DAC/GCOMP_DAC (C1_GCOMP_DAC.2 C2_GCOMP_DAC.2 C3_GCOMP_DAC.2 C4_GCOMP_DAC.2), Power/DAC/EL_DAC (C1_EL_DAC.2 C2_EL_DAC.2 C3_EL_DAC.2 C4_EL_DAC.2), Power/DAC/GLDIST_DAC (C1_GLDIST_DAC.2 C2_GLDIST_DAC.2 C3_GLDIST_DAC.2 C4_GLDIST_DAC.2), Power/DAC/VTAU0_DAC (C1_VTAU0_DAC.2 C2_VTAU0_DAC.2 C3_VTAU0_DAC.2 C4_VTAU0_DAC.2), Power/DAC/VTAU2_DAC (C1_VTAU2_DAC.2 C2_VTAU2_DAC.2 C3_VTAU2_DAC.2 C4_VTAU2_DAC.2), Power/DAC/GLPROX_DAC (C1_GLPROX_DAC.2 C2_GLPROX_DAC.2 C3_GLPROX_DAC.2 C4_GLPROX_DAC.2), Power/DAC/VTAU3_DAC (C1_VTAU3_DAC.2 C2_VTAU3_DAC.2 C3_VTAU3_DAC.2 C4_VTAU3_DAC.2), Power/DAC/VB_BUFF_DAC (C1_VB_BUFF_DAC.2 C2_VB_BUFF_DAC.2 C3_VB_BUFF_DAC.2 C4_VB_BUFF_DAC.2), Power/DAC/VREFR_DAC (C1_VREFR_DAC.2 C2_VREFR_DAC.2 C3_VREFR_DAC.2 C4_VREFR_DAC.2), Power/DAC/VSS_SYN_DAC (C1_VSS_SYN_DAC.2 C2_VSS_SYN_DAC.2 C3_VSS_SYN_DAC.2 C4_VSS_SYN_DAC.2), Power/DAC/VAMP_LOW_DAC (C1_VAMP_LOW_DAC.2 C2_VAMP_LOW_DAC.2 C3_VAMP_LOW_DAC.2 C4_VAMP_LOW_DAC.2), Power/DAC/VBIAS_SF_DAC (C1_VBIAS_SF_DAC.2 C2_VBIAS_SF_DAC.2 C3_VBIAS_SF_DAC.2 C4_VBIAS_SF_DAC.2), Power/DAC/SYN_DRLO_DAC (C1_SYN_DRLO_DAC.2 C2_SYN_DRLO_DAC.2 C3_SYN_DRLO_DAC.2 C4_SYN_DRLO_DAC.2), Power/DAC/VAMP_HI_DAC (C1_VAMP_HI_DAC.2 C2_VAMP_HI_DAC.2 C3_VAMP_HI_DAC.2 C4_VAMP_HI_DAC.2), Power/DAC/VSPIKE_DAC (C1_VSPIKE_DAC.2 C2_VSPIKE_DAC.2 C3_VSPIKE_DAC.2 C4_VSPIKE_DAC.2), Power/DAC/VPDN_DAC (C1_VPDN_DAC.2 C2_VPDN_DAC.2 C3_VPDN_DAC.2 C4_VPDN_DAC.2), Power/DAC/V_EREV0_DAC (C1_V_EREV0_DAC.2 C2_V_EREV0_DAC.2 C3_V_EREV0_DAC.2 C4_V_EREV0_DAC.2), Power/DAC/V_EREV1_DAC (C1_V_EREV1_DAC.2 C2_V_EREV1_DAC.2 C3_V_EREV1_DAC.2 C4_V_EREV1_DAC.2), Power/DAC/V_EREV2_DAC (C1_V_EREV2_DAC.2 C2_V_EREV2_DAC.2 C3_V_EREV2_DAC.2 C4_V_EREV2_DAC.2), Power/DAC/V_EREV3_DAC (C1_V_EREV3_DAC.2 C2_V_EREV3_DAC.2 C3_V_EREV3_DAC.2 C4_V_EREV3_DAC.2), Power/DAC/VBIAS_DAC (C1_VBIAS_DAC.2 C2_VBIAS_DAC.2 C3_VBIAS_DAC.2 C4_VBIAS_DAC.2), Power/DAC/VRESET_DAC (C1_VRESET_DAC.2 C2_VRESET_DAC.2 C3_VRESET_DAC.2 C4_VRESET_DAC.2), Power/DAC/VTHRESH_DAC (C1_VTHRESH_DAC.2 C2_VTHRESH_DAC.2 C3_VTHRESH_DAC.2 C4_VTHRESH_DAC.2), Power/DAC/VBP_DAC (C1_VBP_DAC.2 C2_VBP_DAC.2 C3_VBP_DAC.2 C4_VBP_DAC.2), Power/DAC/WBIAS_HI_DAC (C1_WBIAS_HI_DAC.2 C2_WBIAS_HI_DAC.2 C3_WBIAS_HI_DAC.2 C4_WBIAS_HI_DAC.2), Power/DAC/WBIAS_LO_DAC (C1_WBIAS_LO_DAC.2 C2_WBIAS_LO_DAC.2 C3_WBIAS_LO_DAC.2 C4_WBIAS_LO_DAC.2), Power/DAC/IN_IBIAS_DAC (C1_IN_IBIAS_DAC.2 C2_IN_IBIAS_DAC.2 C3_IN_IBIAS_DAC.2 C4_IN_IBIAS_DAC.2), Power/DAC/WBIAS_DAC (C1_WBIAS_DAC.2 C2_WBIAS_DAC.2 C3_WBIAS_DAC.2 C4_WBIAS_DAC.2), Power/DAC/VpupReq_DAC (C1_VpupReq_DAC.2 C2_VpupReq_DAC.2 C3_VpupReq_DAC.2 C4_VpupReq_DAC.2), Power/DAC/Vpup_arb_DAC (C1_Vpup_arb_DAC.2 C2_Vpup_arb_DAC.2 C3_Vpup_arb_DAC.2 C4_Vpup_arb_DAC.2), Power/DAC/VDD_1.2_DAC (C1_VDD_1.2_DAC.2 C2_VDD_1.2_DAC.2 C3_VDD_1.2_DAC.2 C4_VDD_1.2_DAC.2), Sig_Acq (27 pins), U_Sig_Acq/C_+VDC3 (C1_C_+VDC3.2 C2_C_+VDC3.1 C3_C_+VDC3.1), U_Sig_Acq/C_+VDC2 (C1_C_+VDC2.2 C2_C_+VDC2.1 C3_C_+VDC2.1), U_Sig_Acq/C_+VDC1 (C1_C_+VDC1.2 C2_C_+VDC1.1 C3_C_+VDC1.1), U_Sig_Acq/DVDD_ADC (C1_DVDD_ADC.2 C2_DVDD_ADC.2 C3_DVDD_ADC.2 C4_DVDD_ADC.2), U_Sig_Acq/REF_ADC (C1_REF_ADC.2 C2_REF_ADC.2 C3_REF_ADC.2 C4_REF_ADC.2), U_Sig_Acq/AVDD_ADC (C1_AVDD_ADC.2 C2_AVDD_ADC.2 C3_AVDD_ADC.2 C4_AVDD_ADC.2), BRK7010_sj (26 pins), BRK7010/+VDC_FPGA1 (C1_+VDC_FPGA1.2 C2_+VDC_FPGA1.2 C3_+VDC_FPGA1.2 C4_+VDC_FPGA1.2), BRK7010/C_VCCO2_FPGA (C1_C_VCCO2_FPGA.2 C2_C_VCCO2_FPGA.1 C3_C_VCCO2_FPGA.1), BRK7010/+VDC_FPGA2 (C1_+VDC_FPGA2.2 C2_+VDC_FPGA2.2 C3_+VDC_FPGA2.2 C4_+VDC_FPGA2.2), BRK7010/+VDC_FPGA3 (C1_+VDC_FPGA3.2 C2_+VDC_FPGA3.2 C3_+VDC_FPGA3.2 C4_+VDC_FPGA3.2), BRK7010/+VDC_FPGA5 (C1_+VDC_FPGA5.2 C2_+VDC_FPGA5.1 C3_+VDC_FPGA5.1), BRK7010/+VDC_FPGA6 (C1_+VDC_FPGA6.2 C2_+VDC_FPGA6.1 C3_+VDC_FPGA6.1), BRK7010/+VDC_FPGA4 (C1_+VDC_FPGA4.2 C2_+VDC_FPGA4.2 C3_+VDC_FPGA4.2 C4_+VDC_FPGA4.2), BRK7010/+VDC_FPGA7 (C1_+VDC_FPGA7.2 C2_+VDC_FPGA7.1 C3_+VDC_FPGA7.1), BRK7010/C_VCCO1_FPGA (C1_C_VCCO1_FPGA.2 C2_C_VCCO1_FPGA.1 C3_C_VCCO1_FPGA.1)
VCCO_MC1: Power (H_VDD_1.2.2), BRK7010_sj (8 pins), BRK7010/C_VCCO2_FPGA (C1_C_VCCO2_FPGA.1 C2_C_VCCO2_FPGA.2 C3_C_VCCO2_FPGA.2), BRK7010/C_VCCO1_FPGA (C1_C_VCCO1_FPGA.1 C2_C_VCCO1_FPGA.2 C3_C_VCCO1_FPGA.2)
+VDC_1.8_LDO: Power (H_PWR_1.8V.2), Power/LDO_All/DVDD (7 pins), Power/LDO_All/VDD_1.2 (7 pins)
+VDC_3.3_LDO: Power (H_PWR_3.3V.2), Power/LDO_All/AVDD (7 pins), Power/LDO_All/DVDD_HIGH (7 pins), Power/LDO_All/EVDD (7 pins), Power/LDO_All/VREF_2v (7 pins), Power/LDO_All/VREF_1.8 (7 pins)
+VDC_ADC: Sig_Acq (ADC.A2 ADC.A3 H_PWR_ADC.2), U_Sig_Acq/DVDD_ADC (C1_DVDD_ADC.1 C2_DVDD_ADC.1 C3_DVDD_ADC.1 C4_DVDD_ADC.1), U_Sig_Acq/AVDD_ADC (C1_AVDD_ADC.1 C2_AVDD_ADC.1 C3_AVDD_ADC.1 C4_AVDD_ADC.1)
+VDC_BUFF: Sig_Acq (Buffer1.10 Buffer2.10 Buffer3.10 H_PWR_BUFF.2), U_Sig_Acq/C_+VDC3 (C1_C_+VDC3.1 C2_C_+VDC3.2 C3_C_+VDC3.2), U_Sig_Acq/C_+VDC2 (C1_C_+VDC2.1 C2_C_+VDC2.2 C3_C_+VDC2.2), U_Sig_Acq/C_+VDC1 (C1_C_+VDC1.1 C2_C_+VDC1.2 C3_C_+VDC1.2)
+VDC_DAC: DAC (5 pins), Power/DAC/VDC_DAC2 (C1_VDC_DAC2.1 C2_VDC_DAC2.1 C3_VDC_DAC2.1 C4_VDC_DAC2.1), Power/DAC/VDC_DAC3 (C1_VDC_DAC3.1 C2_VDC_DAC3.1 C3_VDC_DAC3.1 C4_VDC_DAC3.1), Power/DAC/VDC_DAC4 (C1_VDC_DAC4.1 C2_VDC_DAC4.1 C3_VDC_DAC4.1 C4_VDC_DAC4.1), Power/DAC/VDC_DAC5 (C1_VDC_DAC5.1 C2_VDC_DAC5.1 C3_VDC_DAC5.1 C4_VDC_DAC5.1)
+VDC_DAC1: DAC (DAC1.3 H_PWR_DAC1.2), Power/DAC/VDC_DAC1 (C1_VDC_DAC1.1 C2_VDC_DAC1.1 C3_VDC_DAC1.1 C4_VDC_DAC1.1)
+VDC_LDO: Power (H_PWR_5V.2), Power/LDO_All/VDD_3.3 (7 pins)
_setLFSR: IFAT6_QFP (IFAT6.50), BRK7010_sj (J4.4 MC2.44)
ADC_~{CS}: Sig_Acq (ADC.C4), BRK7010_sj (J4.31 MC2.71)
ADC_SCLK: Sig_Acq (ADC.D4), BRK7010_sj (J4.29 MC2.69)
ADC_SDI: Sig_Acq (ADC.D2), BRK7010_sj (J4.27 MC2.67)
ADC_SDO: Sig_Acq (ADC.D3), BRK7010_sj (J2.10)
ARRAY_SHIFT_REG_CLK: IFAT6_QFP (IFAT6.32), BRK7010_sj (J3.20 MC2.20)
ASYNC_RST: IFAT6_QFP (IFAT6.30), BRK7010_sj (J3.16 MC2.16)
AVDD: IFAT6_QFP (IFAT6.65 IFAT6.87), IFAT6_Chip_QFP/C_AVDD (C1_C_AVDD.1 C2_C_AVDD.2 C3_C_AVDD.2), IFAT6_Chip_QFP/C_AVDD1 (C1_C_AVDD1.1 C2_C_AVDD1.2 C3_C_AVDD1.2), Power (10 pins)
AVDD_DAC: Power (H_AVDD.1), DAC (DAC1.12), Power/DAC/AVDD_DAC (C1_AVDD_DAC.1 C2_AVDD_DAC.1 C3_AVDD_DAC.1 C4_AVDD_DAC.1)
AVDD_LDO: Power (H_AVDD.3), Power/LDO_All/AVDD (LDO_AVDD.10 LDO_AVDD.11 LDO_AVDD.12), Power/LDO_All/AVDD/U_Capx4 (C1_Power_LDO_All_AVDD_U_Capx4.1 C2_Power_LDO_All_AVDD_U_Capx4.1 C3_Power_LDO_All_AVDD_U_Capx4.1 C4_Power_LDO_All_AVDD_U_Capx4.1)
COL_SHIFT_REG_CLK: IFAT6_QFP (IFAT6.28), BRK7010_sj (J2.14 MC1.54)
DAC1_~{CLR}: DAC (DAC1.9), BRK7010_sj (J4.35 MC2.75)
DAC1_~{LDAC}: DAC (DAC1.1), BRK7010_sj (J4.36 MC2.76)
DAC1_~{SYNC}: DAC (DAC1.2), BRK7010_sj (J4.34 MC2.74)
DAC1_SDI: DAC (DAC1.15), BRK7010_sj (J4.33 MC2.73)
DAC2_~{CLR}: DAC (DAC2.9), BRK7010_sj (J2.30 MC1.70)
DAC2_~{LDAC}: DAC (DAC2.1), BRK7010_sj (J2.35 MC1.75)
DAC2_~{SYNC}: DAC (DAC2.2), BRK7010_sj (J2.24 MC1.64)
DAC2_SDI: DAC (DAC2.15), BRK7010_sj (J2.28 MC1.68)
DAC3_~{CLR}: DAC (DAC3.9), BRK7010_sj (J2.33 MC1.73)
DAC3_~{LDAC}: DAC (DAC3.1), BRK7010_sj (J2.27 MC1.67)
DAC3_~{SYNC}: DAC (DAC3.2), BRK7010_sj (J2.29 MC1.69)
DAC3_SDI: DAC (DAC3.15), BRK7010_sj (J2.31 MC1.71)
DAC4_~{CLR}: DAC (DAC4.9), BRK7010_sj (J4.32 MC2.72)
DAC4_~{LDAC}: DAC (DAC4.1), BRK7010_sj (J4.26 MC2.66)
DAC4_~{SYNC}: DAC (DAC4.2), BRK7010_sj (J4.28 MC2.68)
DAC4_SDI: DAC (DAC4.15), BRK7010_sj (J4.30 MC2.70)
DAC5_~{CLR}: DAC (DAC5.9), BRK7010_sj (J2.32 MC1.72)
DAC5_~{LDAC}: DAC (DAC5.1), BRK7010_sj (J2.34 MC1.74)
DAC5_~{SYNC}: DAC (DAC5.2), BRK7010_sj (J4.24 MC2.64)
DAC5_SDI: DAC (DAC5.15), BRK7010_sj (J2.36 MC1.76)
DAC_SCLK: DAC (5 pins), BRK7010_sj (J2.26 MC1.66)
DAC_VREF_1.8: Power (H_VREF_1.8.2), DAC (DAC5.8), Power/DAC/VREF_DAC5 (C1_VREF_DAC5.1 C2_VREF_DAC5.1 C3_VREF_DAC5.1 C4_VREF_DAC5.1), Sig_Acq (ADC.A4), U_Sig_Acq/REF_ADC (C1_REF_ADC.1 C2_REF_ADC.1 C3_REF_ADC.1 C4_REF_ADC.1)
DAC_VREF_2: Power (H_VREF_2.2), DAC (DAC2.8 DAC3.8 DAC4.8), Power/DAC/VREF_DAC2 (C1_VREF_DAC2.1 C2_VREF_DAC2.1 C3_VREF_DAC2.1 C4_VREF_DAC2.1), Power/DAC/VREF_DAC3 (C1_VREF_DAC3.1 C2_VREF_DAC3.1 C3_VREF_DAC3.1 C4_VREF_DAC3.1), Power/DAC/VREF_DAC4 (C1_VREF_DAC4.1 C2_VREF_DAC4.1 C3_VREF_DAC4.1 C4_VREF_DAC4.1)
DAC_VREF_INT: DAC (DAC1.8), Power/DAC/VREF_DAC1 (C1_VREF_DAC1.1 C2_VREF_DAC1.1 C3_VREF_DAC1.1 C4_VREF_DAC1.1)
DVDD: IFAT6_QFP (IFAT6.52), IFAT6_Chip_QFP/DVDD (C1_DVDD.1 C2_DVDD.2 C3_DVDD.2), Power (H_DVDD.2)
DVDD_DAC: Power (H_DVDD.1), DAC (DAC1.13), Power/DAC/DVDD_DAC (C1_DVDD_DAC.1 C2_DVDD_DAC.1 C3_DVDD_DAC.1 C4_DVDD_DAC.1)
DVDD_HIGH: IFAT6_QFP (IFAT6.61), IFAT6_Chip_QFP/DVDD_HI (C1_DVDD_HI.1 C2_DVDD_HI.2 C3_DVDD_HI.2), Power (H_DVDD_HIGH.2)
DVDD_HIGH_DAC: Power (H_DVDD_HIGH.1), DAC (DAC1.6), Power/DAC/DVDD_HI_DAC (C1_DVDD_HI_DAC.1 C2_DVDD_HI_DAC.1 C3_DVDD_HI_DAC.1 C4_DVDD_HI_DAC.1)
DVDD_HIGH_LDO: Power (H_DVDD_HIGH.3), Power/LDO_All/DVDD_HIGH (LDO_DVDD_HIGH.10 LDO_DVDD_HIGH.11 LDO_DVDD_HIGH.12), Power/LDO_All/DVDD_HIGH/U_Capx4 (C1_Power_LDO_All_DVDD_HIGH_U_Capx4.1 C2_Power_LDO_All_DVDD_HIGH_U_Capx4.1 C3_Power_LDO_All_DVDD_HIGH_U_Capx4.1 C4_Power_LDO_All_DVDD_HIGH_U_Capx4.1)
DVDD_LDO: Power (H_DVDD.3), Power/LDO_All/DVDD (LDO_DVDD.10 LDO_DVDD.11 LDO_DVDD.12), Power/LDO_All/DVDD/U_Capx4 (C1_Power_LDO_All_DVDD_U_Capx4.1 C2_Power_LDO_All_DVDD_U_Capx4.1 C3_Power_LDO_All_DVDD_U_Capx4.1 C4_Power_LDO_All_DVDD_U_Capx4.1)
E_REV0: IFAT6_QFP (IFAT6.80), IFAT6_Chip_QFP/E_REV0 (C1_E_REV0.1 C2_E_REV0.2 C3_E_REV0.2), Power (C_EREV0.2 H_EREV0.2 R_EREV0.2)
E_REV1: IFAT6_QFP (IFAT6.79), IFAT6_Chip_QFP/E_REV1 (C1_E_REV1.1 C2_E_REV1.2 C3_E_REV1.2), Power (C_EREV1.2 H_EREV1.2 R_EREV1.2)
E_REV2: IFAT6_QFP (IFAT6.78), IFAT6_Chip_QFP/E_REV2 (C1_E_REV2.1 C2_E_REV2.2 C3_E_REV2.2), Power (C_EREV2.2 H_EREV2.2 R_EREV2.2)
E_REV3: IFAT6_QFP (IFAT6.77), IFAT6_Chip_QFP/E_REV3 (C1_E_REV3.1 C2_E_REV3.2 C3_E_REV3.2), Power (C_EREV3.2 H_EREV3.2 R_EREV3.2)
ELEAK: IFAT6_QFP (IFAT6.96), IFAT6_Chip_QFP/ELEAK (C1_ELEAK.1 C2_ELEAK.2 C3_ELEAK.2), Power (C_ELEAK.2 H_ELEAK.2 R_ELEAK.2)
ELEAK_DAC: Power (H_ELEAK.1 R_ELEAK.1), DAC (DAC2.11), Power/DAC/EL_DAC (C1_EL_DAC.1 C2_EL_DAC.1 C3_EL_DAC.1 C4_EL_DAC.1)
EVDD: IFAT6_QFP (IFAT6.63 IFAT6.99), IFAT6_Chip_QFP/C_EVDD (C1_IFAT6_Chip_QFP_C_EVDD#1.1 C2_IFAT6_Chip_QFP_C_EVDD#1.2 C3_IFAT6_Chip_QFP_C_EVDD#1.2), IFAT6_Chip_QFP/C_EVDD (C1_IFAT6_Chip_QFP_C_EVDD#2.1 C2_IFAT6_Chip_QFP_C_EVDD#2.2 C3_IFAT6_Chip_QFP_C_EVDD#2.2), Power (H_EVDD.2)
EVDD_DAC: Power (H_EVDD.1), DAC (DAC1.11), Power/DAC/EVDD_DAC (C1_EVDD_DAC.1 C2_EVDD_DAC.1 C3_EVDD_DAC.1 C4_EVDD_DAC.1)
EVDD_LDO: Power (H_EVDD.3), Power/LDO_All/EVDD (LDO_EVDD.10 LDO_EVDD.11 LDO_EVDD.12), Power/LDO_All/EVDD/U_Capx4 (C1_Power_LDO_All_EVDD_U_Capx4.1 C2_Power_LDO_All_EVDD_U_Capx4.1 C3_Power_LDO_All_EVDD_U_Capx4.1 C4_Power_LDO_All_EVDD_U_Capx4.1)
GCOMP: IFAT6_QFP (IFAT6.97), IFAT6_Chip_QFP/GCOMP (C1_GCOMP.1 C2_GCOMP.2 C3_GCOMP.2), Power (C_GCOMP.2 H_GCOMP.2 R_COMP.1)
GCOMP_DAC: Power (H_GCOMP.1 R_COMP.2), DAC (DAC2.10), Power/DAC/GCOMP_DAC (C1_GCOMP_DAC.1 C2_GCOMP_DAC.1 C3_GCOMP_DAC.1 C4_GCOMP_DAC.1)
GLEAK_DISTAL: IFAT6_QFP (IFAT6.95), IFAT6_Chip_QFP/GL_DIS (C1_GL_DIS.1 C2_GL_DIS.2 C3_GL_DIS.2), Power (C_GLEAKD.2 H_GLEAKD.2 R_GLEAKD.1)
GLEAK_DISTAL_DAC: Power (H_GLEAKD.1 R_GLEAKD.2), DAC (DAC2.12), Power/DAC/GLDIST_DAC (C1_GLDIST_DAC.1 C2_GLDIST_DAC.1 C3_GLDIST_DAC.1 C4_GLDIST_DAC.1)
GLEAK_PROXIMAL: IFAT6_QFP (IFAT6.94), IFAT6_Chip_QFP/GL_PROX (C1_GL_PROX.1 C2_GL_PROX.2 C3_GL_PROX.2), Power (C_GLEAKP.2 H_GLEAKP.2 R_GLEAKP.1)
GLEAK_PROXIMAL_DAC: Power (H_GLEAKP.1 R_GLEAKP.2), DAC (DAC2.13), Power/DAC/GLPROX_DAC (C1_GLPROX_DAC.1 C2_GLPROX_DAC.1 C3_GLPROX_DAC.1 C4_GLPROX_DAC.1)
INPUT_DATA0: IFAT6_QFP (IFAT6.1), BRK7010_sj (J3.15 MC2.15)
INPUT_DATA1: IFAT6_QFP (IFAT6.2), BRK7010_sj (J3.17 MC2.17)
INPUT_DATA2: IFAT6_QFP (IFAT6.3), BRK7010_sj (J3.19 MC2.19)
INPUT_DATA3: IFAT6_QFP (IFAT6.4), BRK7010_sj (J3.21 MC2.21)
INPUT_DATA4: IFAT6_QFP (IFAT6.5), BRK7010_sj (J3.23 MC2.23)
INPUT_DATA5: IFAT6_QFP (IFAT6.6), BRK7010_sj (J3.25 MC2.25)
INPUT_DATA6: IFAT6_QFP (IFAT6.7), BRK7010_sj (J3.27 MC2.27)
INPUT_DATA7: IFAT6_QFP (IFAT6.8), BRK7010_sj (J3.29 MC2.29)
INPUT_DATA8: IFAT6_QFP (IFAT6.9), BRK7010_sj (J3.31 MC2.31)
INPUT_DATA9: IFAT6_QFP (IFAT6.10), BRK7010_sj (J3.33 MC2.33)
INPUT_DATA10: IFAT6_QFP (IFAT6.11), BRK7010_sj (J3.37 MC2.37)
INPUT_DATA11: IFAT6_QFP (IFAT6.12), BRK7010_sj (J3.39 MC2.39)
INPUT_DATA12: IFAT6_QFP (IFAT6.13), BRK7010_sj (J4.1 MC2.41)
INPUT_DATA13: IFAT6_QFP (IFAT6.14), BRK7010_sj (J4.3 MC2.43)
INPUT_DATA14: IFAT6_QFP (IFAT6.15), BRK7010_sj (J4.5 MC2.45)
INPUT_DATA15: IFAT6_QFP (IFAT6.16), BRK7010_sj (J4.7 MC2.47)
INPUT_DATA16: IFAT6_QFP (IFAT6.17), BRK7010_sj (J4.9 MC2.49)
INPUT_DATA17: IFAT6_QFP (IFAT6.18), BRK7010_sj (J4.11 MC2.51)
INPUT_DATA18: IFAT6_QFP (IFAT6.19), BRK7010_sj (J4.13 MC2.53)
INPUT_DATA19: IFAT6_QFP (IFAT6.20), BRK7010_sj (J4.17 MC2.57)
INPUT_DATA20: IFAT6_QFP (IFAT6.21), BRK7010_sj (J4.19 MC2.59)
INPUT_DATA21: IFAT6_QFP (IFAT6.22), BRK7010_sj (J4.21 MC2.61)
INPUT_DATA22: IFAT6_QFP (IFAT6.23), BRK7010_sj (J4.23 MC2.63)
INPUT_DATA23: IFAT6_QFP (IFAT6.24), BRK7010_sj (J4.25 MC2.65)
INPUT_DATA_ACK: IFAT6_QFP (IFAT6.26), BRK7010_sj (J2.20 MC1.60)
INPUT_DATA_REQ: IFAT6_QFP (IFAT6.25), BRK7010_sj (J2.22 MC1.62)
MC1_52: IFAT6_QFP (IFAT6.29), BRK7010_sj (J2.12 MC1.52)
MC1_58: IFAT6_QFP (IFAT6.27), BRK7010_sj (J2.18 MC1.58)
MC2_18: IFAT6_QFP (IFAT6.31), BRK7010_sj (J3.18 MC2.18)
MC2_22: IFAT6_QFP (IFAT6.33), BRK7010_sj (J3.22 MC2.22)
MC2_24: IFAT6_QFP (IFAT6.34), BRK7010_sj (J3.24 MC2.24)
MC2_26: IFAT6_QFP (IFAT6.35), BRK7010_sj (J3.26 MC2.26)
MC2_28: IFAT6_QFP (IFAT6.36), BRK7010_sj (J3.28 MC2.28)
MC2_30: IFAT6_QFP (IFAT6.37), BRK7010_sj (J3.30 MC2.30)
MC2_32: IFAT6_QFP (IFAT6.38), BRK7010_sj (J3.32 MC2.32)
MC2_34: IFAT6_QFP (IFAT6.39), BRK7010_sj (J3.34 MC2.34)
MC2_38: IFAT6_QFP (IFAT6.40), BRK7010_sj (J3.38 MC2.38)
MC2_40: IFAT6_QFP (IFAT6.41), BRK7010_sj (J3.40 MC2.40)
MC2_42: IFAT6_QFP (IFAT6.51), BRK7010_sj (J4.2 MC2.42)
MC2_46: IFAT6_QFP (IFAT6.49), BRK7010_sj (J4.6 MC2.46)
MC2_48: IFAT6_QFP (IFAT6.48), BRK7010_sj (J4.8 MC2.48)
MC2_50: IFAT6_QFP (IFAT6.47), BRK7010_sj (J4.10 MC2.50)
MC2_52: IFAT6_QFP (IFAT6.46), BRK7010_sj (J4.12 MC2.52)
MC2_54: IFAT6_QFP (IFAT6.45), BRK7010_sj (J4.14 MC2.54)
MC2_58: IFAT6_QFP (IFAT6.44), BRK7010_sj (J4.18 MC2.58)
MC2_60: IFAT6_QFP (IFAT6.43), BRK7010_sj (J4.20 MC2.60)
MC2_62: IFAT6_QFP (IFAT6.42), BRK7010_sj (J4.22 MC2.62)
NetC_3_AVDD_1: LDO_All (R_AVDD.2), Power/LDO_All/AVDD (C_3_AVDD.1 C_4_AVDD.1 LDO_AVDD.8)
NetC_3_DVDD_1: LDO_All (R_DVDD.2), Power/LDO_All/DVDD (C_3_DVDD.1 C_4_DVDD.1 LDO_DVDD.8)
NetC_3_DVDD_HIGH_1: LDO_All (R_DVDD_HIGH.2), Power/LDO_All/DVDD_HIGH (C_3_DVDD_HIGH.1 C_4_DVDD_HIGH.1 LDO_DVDD_HIGH.8)
NetC_3_EVDD_1: LDO_All (R_EVDD.2), Power/LDO_All/EVDD (C_3_EVDD.1 C_4_EVDD.1 LDO_EVDD.8)
NetC_3_VDD_1.2_1: LDO_All (R_VDD_1.2.2), Power/LDO_All/VDD_1.2 (C_3_VDD_1.2.1 C_4_VDD_1.2.1 LDO_VDD_1.2.8)
NetC_3_VDD_3.3_1: LDO_All (R_VDD_3.3.2), Power/LDO_All/VDD_3.3 (C_3_VDD_3.3.1 C_4_VDD_3.3.1 LDO_VDD_3.3.8)
NetC_3_VREF_1.8_1: LDO_All (R_VREF_1.8.2), Power/LDO_All/VREF_1.8 (C_3_VREF_1.8.1 C_4_VREF_1.8.1 LDO_VREF_1.8.8)
NetC_3_VREF_2v_1: LDO_All (R_VREF_2v.2), Power/LDO_All/VREF_2v (C_3_VREF_2v.1 C_4_VREF_2v.1 LDO_VREF_2v.8)
SYNAPSE_DRIVE_LOW: IFAT6_QFP (IFAT6.81), IFAT6_Chip_QFP/SYN_DR_LO (C1_SYN_DR_LO.1 C2_SYN_DR_LO.2 C3_SYN_DR_LO.2), Power (C_SYN_DRIVELO.2 H_SYN_DRIVELO.2 R_SYN_DRIVELO.2)
SYNAPSE_DRIVE_LOW_DAC: Power (H_SYN_DRIVELO.1 R_SYN_DRIVELO.1), DAC (DAC3.7), Power/DAC/SYN_DRLO_DAC (C1_SYN_DRLO_DAC.1 C2_SYN_DRLO_DAC.1 C3_SYN_DRLO_DAC.1 C4_SYN_DRLO_DAC.1)
V_EREV0_DAC: Power (H_EREV0.1 R_EREV0.1), DAC (DAC4.13), Power/DAC/V_EREV0_DAC (C1_V_EREV0_DAC.1 C2_V_EREV0_DAC.1 C3_V_EREV0_DAC.1 C4_V_EREV0_DAC.1)
V_EREV1_DAC: Power (H_EREV1.1 R_EREV1.1), DAC (DAC4.12), Power/DAC/V_EREV1_DAC (C1_V_EREV1_DAC.1 C2_V_EREV1_DAC.1 C3_V_EREV1_DAC.1 C4_V_EREV1_DAC.1)
V_EREV2_DAC: Power (H_EREV2.1 R_EREV2.1), DAC (DAC4.11), Power/DAC/V_EREV2_DAC (C1_V_EREV2_DAC.1 C2_V_EREV2_DAC.1 C3_V_EREV2_DAC.1 C4_V_EREV2_DAC.1)
V_EREV3_DAC: Power (H_EREV3.1 R_EREV3.1), DAC (DAC4.10), Power/DAC/V_EREV3_DAC (C1_V_EREV3_DAC.1 C2_V_EREV3_DAC.1 C3_V_EREV3_DAC.1 C4_V_EREV3_DAC.1)
V_TAU0: IFAT6_QFP (IFAT6.92), IFAT6_Chip_QFP/V_TAU0 (C1_V_TAU0.1 C2_V_TAU0.2 C3_V_TAU0.2), Power (C_VTAU0.2 H_VTAU0.2 R_VTAU0.1)
V_TAU0_DAC: Power (H_VTAU0.1 R_VTAU0.2), DAC (DAC2.7), Power/DAC/VTAU0_DAC (C1_VTAU0_DAC.1 C2_VTAU0_DAC.1 C3_VTAU0_DAC.1 C4_VTAU0_DAC.1)
V_TAU1: IFAT6_QFP (IFAT6.91), IFAT6_Chip_QFP/V_TAU1 (C1_V_TAU1.1 C2_V_TAU1.2 C3_V_TAU1.2), Power (C_VTAU1.2 H_VTAU1.2 R_VTAU1.1)
V_TAU1_DAC: Power (H_VTAU1.1 R_VTAU1.2), DAC (DAC2.6), Power/DAC/VTAU1_DAC (C1_VTAU1_DAC.1 C2_VTAU1_DAC.1 C3_VTAU1_DAC.1 C4_VTAU1_DAC.1)
V_TAU2: IFAT6_QFP (IFAT6.90), IFAT6_Chip_QFP/V_TAU2 (C1_V_TAU2.1 C2_V_TAU2.2 C3_V_TAU2.2), Power (C_VTAU2.2 H_VTAU2.2 R_VTAU2.1)
V_TAU2_DAC: Power (H_VTAU2.1 R_VTAU2.2), DAC (DAC2.5), Power/DAC/VTAU2_DAC (C1_VTAU2_DAC.1 C2_VTAU2_DAC.1 C3_VTAU2_DAC.1 C4_VTAU2_DAC.1)
V_TAU3: IFAT6_QFP (IFAT6.89), IFAT6_Chip_QFP/V_TAU3 (C1_V_TAU3.1 C2_V_TAU3.2 C3_V_TAU3.2), Power (C_VTAU3.2 H_VTAU3.2 R_VTAU3.1)
V_TAU3_DAC: Power (H_VTAU3.1 R_VTAU3.2), DAC (DAC2.4), Power/DAC/VTAU3_DAC (C1_VTAU3_DAC.1 C2_VTAU3_DAC.1 C3_VTAU3_DAC.1 C4_VTAU3_DAC.1)
V_U_PROBE0: IFAT6_QFP (IFAT6.70), Sig_Acq (Buffer1.7 R_V_U0.1)
V_U_PROBE1: IFAT6_QFP (IFAT6.71), Sig_Acq (Buffer1.3 R_V_U1.1)
V_U_PROBE2: IFAT6_QFP (IFAT6.69), Sig_Acq (Buffer3.3 R_V_U2.1)
V_U_PROBE3: IFAT6_QFP (IFAT6.66), Sig_Acq (Buffer2.3 R_V_U3.1)
VAMP_HIGH: IFAT6_QFP (IFAT6.84), IFAT6_Chip_QFP/VAMP_HIGH (C1_VAMP_HIGH.1 C2_VAMP_HIGH.2 C3_VAMP_HIGH.2), Power (C_VAMP_HIGH.2 H_VAMP_HIGH.2 R_VAMP_HIGH.2)
VAMP_HIGH_DAC: Power (H_VAMP_HIGH.1 R_VAMP_HIGH.1), DAC (DAC3.13), Power/DAC/VAMP_HI_DAC (C1_VAMP_HI_DAC.1 C2_VAMP_HI_DAC.1 C3_VAMP_HI_DAC.1 C4_VAMP_HI_DAC.1)
VAMP_LOW: IFAT6_QFP (IFAT6.85), IFAT6_Chip_QFP/VAMP_LOW (C1_VAMP_LOW.1 C2_VAMP_LOW.2 C3_VAMP_LOW.2), Power (C_VAMP_LOW.2 H_VAMP_LOW.2 R_VAMP_LOW.2)
VAMP_LOW_DAC: Power (H_VAMP_LOW.1 R_VAMP_LOW.1), DAC (DAC3.12), Power/DAC/VAMP_LOW_DAC (C1_VAMP_LOW_DAC.1 C2_VAMP_LOW_DAC.1 C3_VAMP_LOW_DAC.1 C4_VAMP_LOW_DAC.1)
VBIAS: IFAT6_QFP (IFAT6.74), IFAT6_Chip_QFP/VBIAS (C1_VBIAS.1 C2_VBIAS.2 C3_VBIAS.2), Power (C_VBIAS.2 H_VBIAS.2 R_VBIAS.1)
VBIAS_DAC: Power (H_VBIAS.1 R_VBIAS.2), DAC (DAC4.7), Power/DAC/VBIAS_DAC (C1_VBIAS_DAC.1 C2_VBIAS_DAC.1 C3_VBIAS_DAC.1 C4_VBIAS_DAC.1)
VBIAS_SF: IFAT6_QFP (IFAT6.83), IFAT6_Chip_QFP/VBIAS_SF (C1_VBIAS_SF.1 C2_VBIAS_SF.2 C3_VBIAS_SF.2), Power (C_VBIAS_SF.2 H_VBIAS_SF.2 R_VBIAS_SF.1)
VBIAS_SF_DAC: Power (H_VBIAS_SF.1 R_VBIAS_SF.2), DAC (DAC3.4), Power/DAC/VBIAS_SF_DAC (C1_VBIAS_SF_DAC.1 C2_VBIAS_SF_DAC.1 C3_VBIAS_SF_DAC.1 C4_VBIAS_SF_DAC.1)
VBIAS_UNITYBUFFER: IFAT6_QFP (IFAT6.82), IFAT6_Chip_QFP/VBIAS_BUFF (C1_VBIAS_BUFF.1 C2_VBIAS_BUFF.2 C3_VBIAS_BUFF.2), Power (C_VBIAS_BUFF.2 H_VBIAS_BUFF.2 R_VBIAS_BUFF.1)
VBIAS_UNITYBUFFER_DAC: Power (H_VBIAS_BUFF.1 R_VBIAS_BUFF.2), DAC (DAC3.5), Power/DAC/VB_BUFF_DAC (C1_VB_BUFF_DAC.1 C2_VB_BUFF_DAC.1 C3_VB_BUFF_DAC.1 C4_VB_BUFF_DAC.1)
VBP: IFAT6_QFP (IFAT6.56), IFAT6_Chip_QFP/VBP (C1_VBP.1 C2_VBP.2 C3_VBP.2), Power (C_VBP.2 H_VBP.2 R_VBP.1)
VBP_DAC: Power (H_VBP.1 R_VBP.2), DAC (DAC5.4), Power/DAC/VBP_DAC (C1_VBP_DAC.1 C2_VBP_DAC.1 C3_VBP_DAC.1 C4_VBP_DAC.1)
VDD3.3: Power (H_VDD_3.3.2), DAC (H_PWR_DAC.1 H_PWR_DAC1.1), Sig_Acq (5 pins)
VDD_1.2_DAC: Power (H_VDD_1.2.1), DAC (DAC5.7), Power/DAC/VDD_1.2_DAC (C1_VDD_1.2_DAC.1 C2_VDD_1.2_DAC.1 C3_VDD_1.2_DAC.1 C4_VDD_1.2_DAC.1)
VDD_1.2_LDO: Power (H_VDD_1.2.3), Power/LDO_All/VDD_1.2 (LDO_VDD_1.2.10 LDO_VDD_1.2.11 LDO_VDD_1.2.12), Power/LDO_All/VDD_1.2/U_Capx4 (C1_Power_LDO_All_VDD_1.2_U_Capx4.1 C2_Power_LDO_All_VDD_1.2_U_Capx4.1 C3_Power_LDO_All_VDD_1.2_U_Capx4.1 C4_Power_LDO_All_VDD_1.2_U_Capx4.1)
VDD_3.3_LDO: Power (H_VDD_3.3.3), Power/LDO_All/VDD_3.3 (LDO_VDD_3.3.10 LDO_VDD_3.3.11 LDO_VDD_3.3.12), Power/LDO_All/VDD_3.3/U_Capx4 (C1_Power_LDO_All_VDD_3.3_U_Capx4.1 C2_Power_LDO_All_VDD_3.3_U_Capx4.1 C3_Power_LDO_All_VDD_3.3_U_Capx4.1 C4_Power_LDO_All_VDD_3.3_U_Capx4.1)
VINPUT_CURRENT_BIAS: IFAT6_QFP (IFAT6.58), IFAT6_Chip_QFP/VIN_IBIAS (C1_VIN_IBIAS.1 C2_VIN_IBIAS.2 C3_VIN_IBIAS.2), Power (C_VIN_IBIAS.2 H_VIN_IBIAS.2 R_VIN_IBIAS.1)
VINPUT_CURRENT_BIAS_DAC: Power (H_VIN_IBIAS.1 R_VIN_IBIAS.2), DAC (DAC5.11), Power/DAC/IN_IBIAS_DAC (C1_IN_IBIAS_DAC.1 C2_IN_IBIAS_DAC.1 C3_IN_IBIAS_DAC.1 C4_IN_IBIAS_DAC.1)
VMEM_DISTAL_PROBE: IFAT6_QFP (IFAT6.68), Sig_Acq (Buffer3.7 R_VM_DISTAL.1)
VMEM_PROXIMAL_PROBE: IFAT6_QFP (IFAT6.67), Sig_Acq (Buffer2.7 R_VM_PROXIMAL.1)
VPDN: IFAT6_QFP (IFAT6.75), IFAT6_Chip_QFP/VPDN (C1_VPDN.1 C2_VPDN.2 C3_VPDN.2), Power (C_VPDN.2 H_VPDN.2 R_VPDN.1)
VPDN_DAC: Power (H_VPDN.1 R_VPDN.2), DAC (DAC4.6), Power/DAC/VPDN_DAC (C1_VPDN_DAC.1 C2_VPDN_DAC.1 C3_VPDN_DAC.1 C4_VPDN_DAC.1)
Vpup_arb: IFAT6_QFP (IFAT6.54), IFAT6_Chip_QFP/VpupArb (C1_VpupArb.1 C2_VpupArb.2 C3_VpupArb.2), Power (C_Vpup_arb.2 H_Vpup_arb.2 R_Vpup_arb.1)
Vpup_arb_DAC: Power (H_Vpup_arb.1 R_Vpup_arb.2), DAC (DAC5.6), Power/DAC/Vpup_arb_DAC (C1_Vpup_arb_DAC.1 C2_Vpup_arb_DAC.1 C3_Vpup_arb_DAC.1 C4_Vpup_arb_DAC.1)
VpupReq: IFAT6_QFP (IFAT6.55), IFAT6_Chip_QFP/VpupReq (C1_VpupReq.1 C2_VpupReq.2 C3_VpupReq.2), Power (C_VpupReq.2 H_VpupReq.2 R_VpupReq.1)
VpupReq_DAC: Power (H_VpupReq.1 R_VpupReq.2), DAC (DAC5.5), Power/DAC/VpupReq_DAC (C1_VpupReq_DAC.1 C2_VpupReq_DAC.1 C3_VpupReq_DAC.1 C4_VpupReq_DAC.1)
VREF_1.8_DAC: Power (H_VREF_1.8.1), DAC (DAC1.5), Power/DAC/VREF_1.8_DAC (C1_VREF_1.8_DAC.1 C2_VREF_1.8_DAC.1 C3_VREF_1.8_DAC.1 C4_VREF_1.8_DAC.1)
VREF_1.8_LDO: Power (H_VREF_1.8.3), Power/LDO_All/VREF_1.8 (LDO_VREF_1.8.10 LDO_VREF_1.8.11 LDO_VREF_1.8.12), Power/LDO_All/VREF_1.8/U_Capx4 (C1_Power_LDO_All_VREF_1.8_U_Capx4.1 C2_Power_LDO_All_VREF_1.8_U_Capx4.1 C3_Power_LDO_All_VREF_1.8_U_Capx4.1 C4_Power_LDO_All_VREF_1.8_U_Capx4.1)
VREF_2_DAC: Power (H_VREF_2.1), DAC (DAC1.4), Power/DAC/VREF_2_DAC (C1_VREF_2_DAC.1 C2_VREF_2_DAC.1 C3_VREF_2_DAC.1 C4_VREF_2_DAC.1)
VREF_2_LDO: Power (H_VREF_2.3), Power/LDO_All/VREF_2v (LDO_VREF_2v.10 LDO_VREF_2v.11 LDO_VREF_2v.12), Power/LDO_All/VREF_2v/U_Capx4 (C1_Power_LDO_All_VREF_2v_U_Capx4.1 C2_Power_LDO_All_VREF_2v_U_Capx4.1 C3_Power_LDO_All_VREF_2v_U_Capx4.1 C4_Power_LDO_All_VREF_2v_U_Capx4.1)
VREFR: IFAT6_QFP (IFAT6.93), IFAT6_Chip_QFP/VREFR (C1_VREFR.1 C2_VREFR.2 C3_VREFR.2), Power (C_VREFR.2 H_VEFR.2 R_VREFR.1)
VREFR_DAC: Power (H_VEFR.1 R_VREFR.2), DAC (DAC3.10), Power/DAC/VREFR_DAC (C1_VREFR_DAC.1 C2_VREFR_DAC.1 C3_VREFR_DAC.1 C4_VREFR_DAC.1)
VRESET: IFAT6_QFP (IFAT6.73), IFAT6_Chip_QFP/VRESET (C1_VRESET.1 C2_VRESET.2 C3_VRESET.2), Power (C_VRESET.2 H_VRESET.2 R_VRESET.2)
VRESET_DAC: Power (H_VRESET.1 R_VRESET.1), DAC (DAC4.5), Power/DAC/VRESET_DAC (C1_VRESET_DAC.1 C2_VRESET_DAC.1 C3_VRESET_DAC.1 C4_VRESET_DAC.1)
VSPIKE: IFAT6_QFP (IFAT6.76), IFAT6_Chip_QFP/VSPIKE (C1_VSPIKE.1 C2_VSPIKE.2 C3_VSPIKE.2), Power (C_VSPIKE.2 H_VSPIKE.2 R_VSPIKE.2)
VSPIKE_DAC: Power (H_VSPIKE.1 R_VSPIKE.1), DAC (DAC3.6), Power/DAC/VSPIKE_DAC (C1_VSPIKE_DAC.1 C2_VSPIKE_DAC.1 C3_VSPIKE_DAC.1 C4_VSPIKE_DAC.1)
VSS_SYN_DAC: Power (H_VSS_SYN.1 R_VSS_SYN.1), DAC (DAC3.11), Power/DAC/VSS_SYN_DAC (C1_VSS_SYN_DAC.1 C2_VSS_SYN_DAC.1 C3_VSS_SYN_DAC.1 C4_VSS_SYN_DAC.1)
VSS_SYNAPSE: IFAT6_QFP (IFAT6.88), IFAT6_Chip_QFP/VSS_SYN (C1_VSS_SYN.1 C2_VSS_SYN.2 C3_VSS_SYN.2), Power (C_VSS_SYN.2 H_VSS_SYN.2 R_VSS_SYN.2)
VTHRESH: IFAT6_QFP (IFAT6.72), IFAT6_Chip_QFP/VTHRESH (C1_VTHRESH.1 C2_VTHRESH.2 C3_VTHRESH.2), Power (C_VTHRESH.2 H_VTHRESH.2 R_VTHRESH.2)
VTHRESH_DAC: Power (H_VTHRESH.1 R_VTHRESH.1), DAC (DAC4.4), Power/DAC/VTHRESH_DAC (C1_VTHRESH_DAC.1 C2_VTHRESH_DAC.1 C3_VTHRESH_DAC.1 C4_VTHRESH_DAC.1)
WIDTH_BIAS: IFAT6_QFP (IFAT6.57), IFAT6_Chip_QFP/WBIAS (C1_WBIAS.1 C2_WBIAS.2 C3_WBIAS.2), Power (C_WIDTH_BIAS.2 H_WIDTH_BIAS.2 R_WIDTH_BIAS.1)
WIDTH_BIAS_DAC: Power (H_WIDTH_BIAS.1 R_WIDTH_BIAS.2), DAC (DAC5.10), Power/DAC/WBIAS_DAC (C1_WBIAS_DAC.1 C2_WBIAS_DAC.1 C3_WBIAS_DAC.1 C4_WBIAS_DAC.1)
WIDTH_BIAS_HIGH: IFAT6_QFP (IFAT6.60), IFAT6_Chip_QFP/WBIAS_HI (C1_WBIAS_HI.1 C2_WBIAS_HI.2 C3_WBIAS_HI.2), Power (C_VWIDTH_HI.2 H_VWIDTH_HI.2 R_VWIDTH_HI.2)
WIDTH_BIAS_HIGH_DAC: Power (H_VWIDTH_HI.1 R_VWIDTH_HI.1), DAC (DAC5.13), Power/DAC/WBIAS_HI_DAC (C1_WBIAS_HI_DAC.1 C2_WBIAS_HI_DAC.1 C3_WBIAS_HI_DAC.1 C4_WBIAS_HI_DAC.1)
WIDTH_BIAS_LOW: IFAT6_QFP (IFAT6.59), IFAT6_Chip_QFP/WBIAS_LO (C1_WBIAS_LO.1 C2_WBIAS_LO.2 C3_WBIAS_LO.2), Power (C_VWIDTH_LO.2 H_VWIDTH_LO.2 R_VWIDTH_LO.2)
WIDTH_BIAS_LOW_DAC: Power (H_VWIDTH_LO.1 R_VWIDTH_LO.1), DAC (DAC5.12), Power/DAC/WBIAS_LO_DAC (C1_WBIAS_LO_DAC.1 C2_WBIAS_LO_DAC.1 C3_WBIAS_LO_DAC.1 C4_WBIAS_LO_DAC.1)